# EAGLE design SparkFun_DataLogger_IoT (EAGLE 9.6.2)
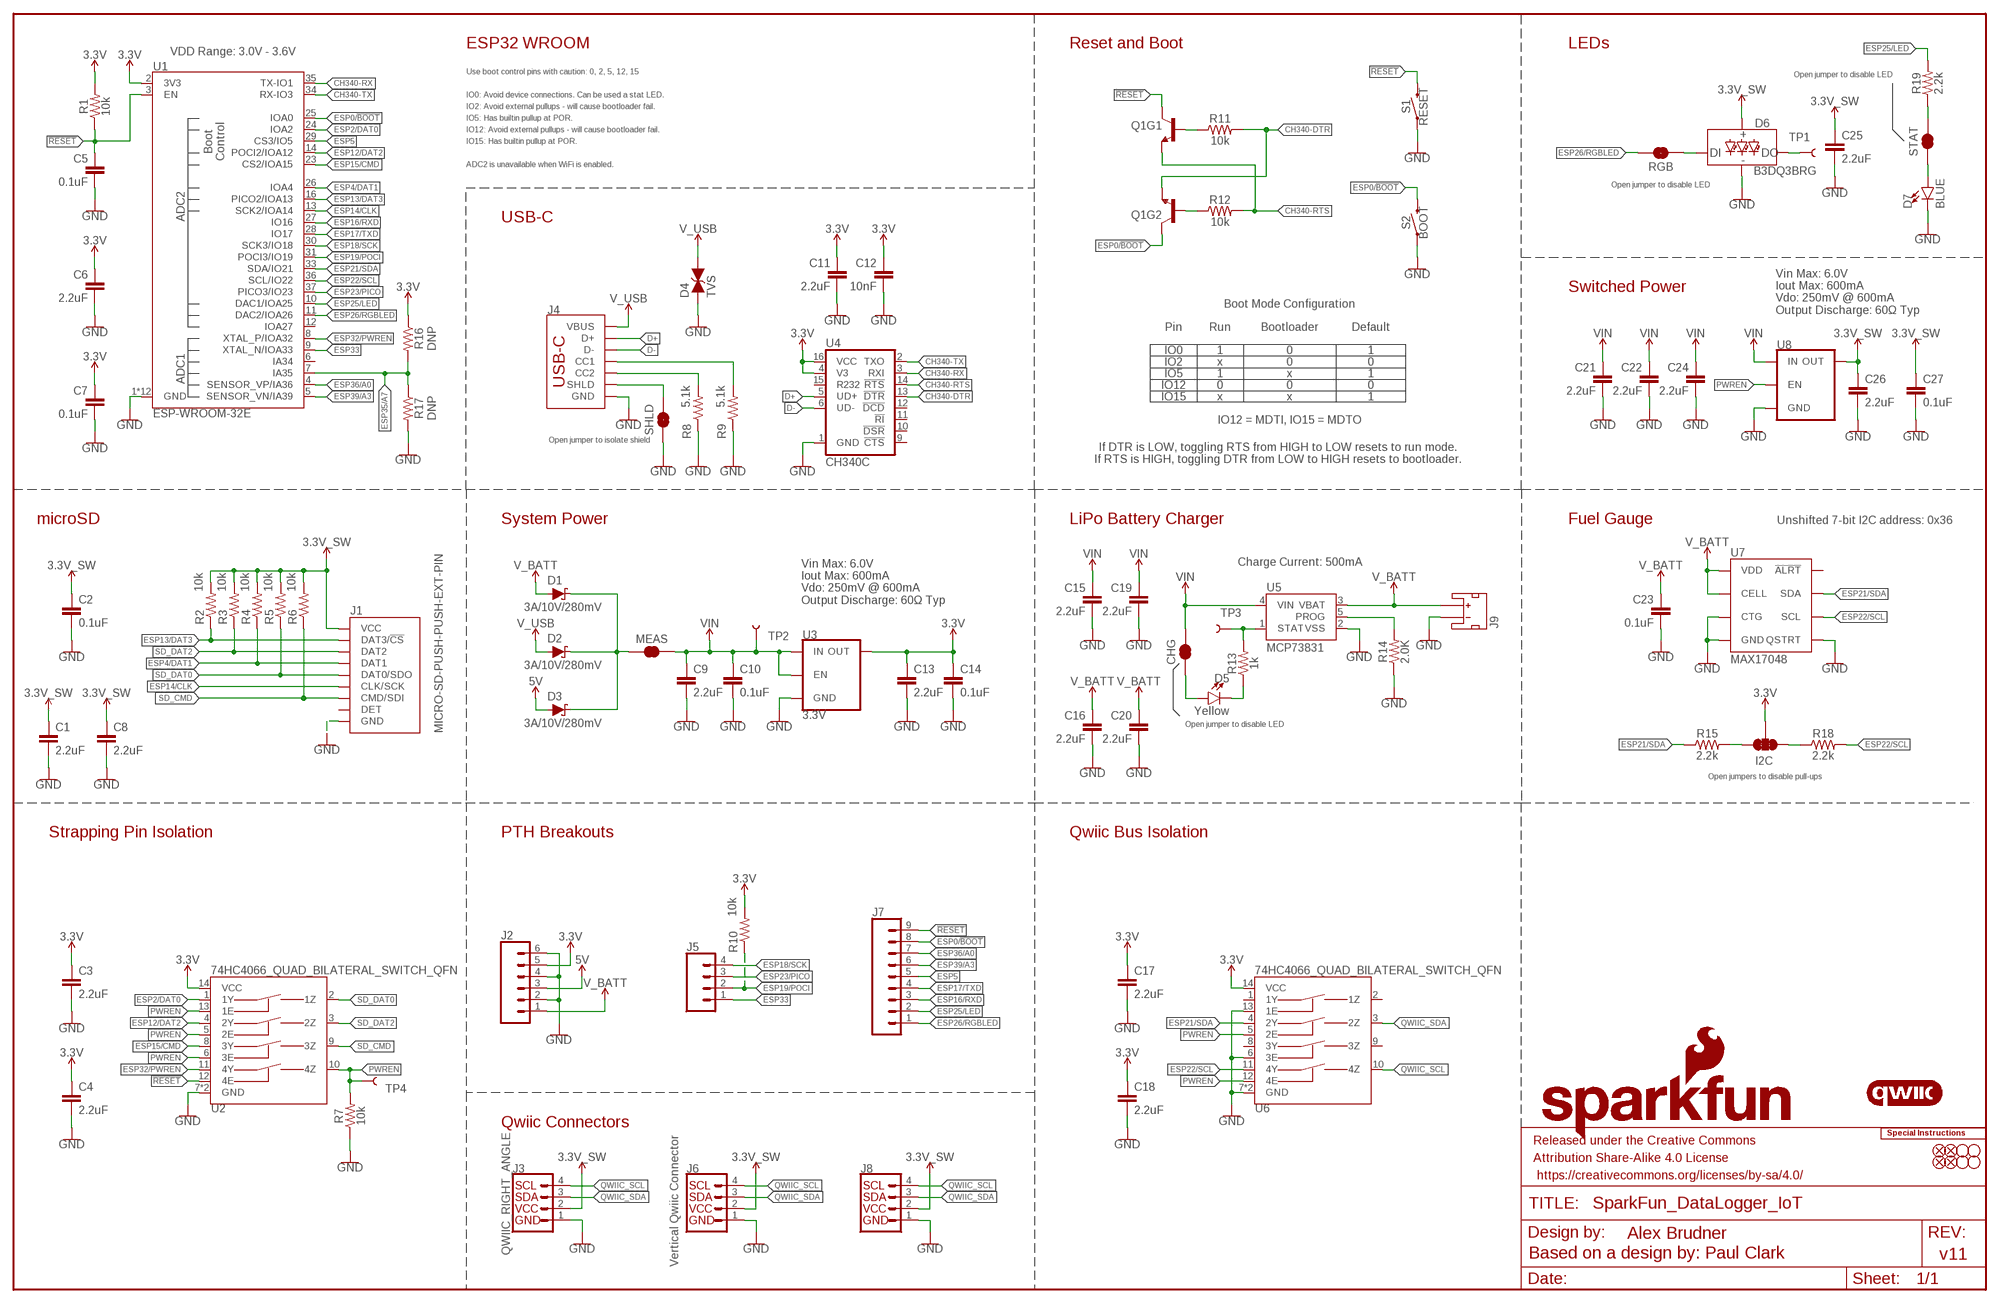
[diagram p0: schematic, sheet 1]

## Parts
C1  2.2uF  2.2UF-0402_TIGHT-10V-10%-X5R  [0402-TIGHT]
C2  0.1uF  0.1UF-0402T-6.3V-10%-X7R  [0402-TIGHT]
C3  2.2uF  2.2UF-0402_TIGHT-10V-10%-X5R  [0402-TIGHT]
C4  2.2uF  2.2UF-0402_TIGHT-10V-10%-X5R  [0402-TIGHT]
C5  0.1uF  0.1UF-0402T-6.3V-10%-X7R  [0402-TIGHT]
C6  2.2uF  2.2UF-0402_TIGHT-10V-10%-X5R  [0402-TIGHT]
C7  0.1uF  0.1UF-0402T-6.3V-10%-X7R  [0402-TIGHT]
C8  2.2uF  2.2UF-0402_TIGHT-10V-10%-X5R  [0402-TIGHT]
C9  2.2uF  2.2UF-0402_TIGHT-10V-10%-X5R  [0402-TIGHT]
C10  0.1uF  0.1UF-0402T-6.3V-10%-X7R  [0402-TIGHT]
C11  2.2uF  2.2UF-0402_TIGHT-10V-10%-X5R  [0402-TIGHT]
C12  10nF  10NF-0402T-25V-10%-X7R-WE  [0402-TIGHT]
C13  2.2uF  2.2UF-0402_TIGHT-10V-10%-X5R  [0402-TIGHT]
C14  0.1uF  0.1UF-0402T-6.3V-10%-X7R  [0402-TIGHT]
C15  2.2uF  2.2UF-0402_TIGHT-10V-10%-X5R  [0402-TIGHT]
C16  2.2uF  2.2UF-0402_TIGHT-10V-10%-X5R  [0402-TIGHT]
C17  2.2uF  2.2UF-0402_TIGHT-10V-10%-X5R  [0402-TIGHT]
C18  2.2uF  2.2UF-0402_TIGHT-10V-10%-X5R  [0402-TIGHT]
C19  2.2uF  2.2UF-0402_TIGHT-10V-10%-X5R  [0402-TIGHT]
C20  2.2uF  2.2UF-0402_TIGHT-10V-10%-X5R  [0402-TIGHT]
C21  2.2uF  2.2UF-0402_TIGHT-10V-10%-X5R  [0402-TIGHT]
C22  2.2uF  2.2UF-0402_TIGHT-10V-10%-X5R  [0402-TIGHT]
C23  0.1uF  0.1UF-0402T-6.3V-10%-X7R  [0402-TIGHT]
C24  2.2uF  2.2UF-0402_TIGHT-10V-10%-X5R  [0402-TIGHT]
C25  2.2uF  2.2UF-0402_TIGHT-10V-10%-X5R  [0402-TIGHT]
C26  2.2uF  2.2UF-0402_TIGHT-10V-10%-X5R  [0402-TIGHT]
C27  0.1uF  0.1UF-0402T-6.3V-10%-X7R  [0402-TIGHT]
CHG  JUMPER-SMT_2_NC_TRACE_SILK  [SMT-JUMPER_2_NC_TRACE_SILK]
D1  3A/10V/280mV  DIODE-SCHOTTKY-BAT60A  [SOD-323]
D2  3A/10V/280mV  DIODE-SCHOTTKY-BAT60A  [SOD-323]
D3  3A/10V/280mV  DIODE-SCHOTTKY-BAT60A  [SOD-323]
D4  TVS  DIODE_TVS  [0603]
D5  Yellow  LED-YELLOW0603  [LED-0603]
D6  B3DQ3BRG  [B3DQ3BRG]
D7  BLUE  LED-BLUE0603  [LED-0603]
FD1  FIDUCIAL1X2  [FIDUCIAL-1X2]
FD2  FIDUCIAL1X2  [FIDUCIAL-1X2]
FD3  FIDUCIAL1X2  [FIDUCIAL-1X2]
FD4  FIDUCIAL1X2  [FIDUCIAL-1X2]
FRAME1  FRAME-LEDGER  [CREATIVE_COMMONS]
H1  STAND-OFFTIGHT  [STAND-OFF-TIGHT]
H2  STAND-OFFTIGHT  [STAND-OFF-TIGHT]
H3  STAND-OFFTIGHT  [STAND-OFF-TIGHT]
H4  STAND-OFFTIGHT  [STAND-OFF-TIGHT]
I2C  JUMPER-SMT_3_2-NC_TRACE_SILK  [SMT-JUMPER_3_2-NC_TRACE_SILK]
J1  MICRO-SD-PUSH-PUSH-EXT-PIN  [MICROSD-EXTERNALPIN]
J2  CONN_06NO_SILK_NO_POP  [1X06_NO_SILK]
J3  QWIIC_RIGHT_ANGLE  QWIIC_CONNECTORJS-1MM  [JST04_1MM_RA]
J4  USB_C_4-LAYER_PADS  [USB-C-16P_4LAYER-PADS]
J5  CONN_041X04_NO_SILK_NO_POP  [1X04_NO_SILK]
J6  Vertical Qwiic Connector  QWIIC_CONNECTOR  [JST04_1MM_VERT]
J7  CONN_09NO_SILK  [1X09_NO_SILK]
J8  I2C_STANDARD_NO_SILK  [1X04_NO_SILK]
J9  JST_2MM_MALE  [JST-2-SMD]
LOGO1  SFE_LOGO_NAME.2_INCH  [SFE_LOGO_NAME_.2]
LOGO2  SFE_LOGO_FLAME.2_INCH  [SFE_LOGO_FLAME_.2]
LOGO3  SPECIAL_INSTRUCTIONS-ORDERING  [ORDERING_INSTRUCTIONS]
LOGO4  QWIIC_LOGO_6MM  [QWIIC_6MM]
MEAS  JUMPER-COMBO_2_NC_TRACE  [COMBO-JUMPER_2_NC_TRACE]
Q1  TRANS_NPN_DUAL-MBT3904DW1T1  [SC70-6]
R1  10k  10KOHM-0402T-1/16W-1%  [0402-TIGHT]
R2  10k  10KOHM-0402T-1/16W-1%  [0402-TIGHT]
R3  10k  10KOHM-0402T-1/16W-1%  [0402-TIGHT]
R4  10k  10KOHM-0402T-1/16W-1%  [0402-TIGHT]
R5  10k  10KOHM-0402T-1/16W-1%  [0402-TIGHT]
R6  10k  10KOHM-0402T-1/16W-1%  [0402-TIGHT]
R7  10k  10KOHM-0402T-1/16W-1%  [0402-TIGHT]
R8  5.1k  5.1KOHM-0402T-1/16W-1%  [0402-TIGHT]
R9  5.1k  5.1KOHM-0402T-1/16W-1%  [0402-TIGHT]
R10  10k  10KOHM-0402T-1/16W-1%  [0402-TIGHT]
R11  10k  10KOHM-0402T-1/16W-1%  [0402-TIGHT]
R12  10k  10KOHM-0402T-1/16W-1%  [0402-TIGHT]
R13  1k  1KOHM-0402T-1/16W-1%  [0402-TIGHT]
R14  2.0K  2.0KOHM-0402T-1/16W-1%  [0402-TIGHT]
R15  2.2k  2.2KOHM-0402T-1/16W-1%  [0402-TIGHT]
R16  DNP  DNP-0402T_NO_CREAM  [0402-TIGHT_NO_CREAM]
R17  DNP  DNP-0402T_NO_CREAM  [0402-TIGHT_NO_CREAM]
R18  2.2k  2.2KOHM-0402T-1/16W-1%  [0402-TIGHT]
R19  2.2k  2.2KOHM-0402T-1/16W-1%  [0402-TIGHT]
RGB  JUMPER-SMT_2_NC_TRACE_SILK  [SMT-JUMPER_2_NC_TRACE_SILK]
S1  RESET  MOMENTARY-SWITCH-SPST-SMD-RIGHT-ANGLE  [TACTILE_SWITCH_SMD_RIGHT_ANGLE]
S2  BOOT  MOMENTARY-SWITCH-SPST-SMD-RIGHT-ANGLE  [TACTILE_SWITCH_SMD_RIGHT_ANGLE]
SHLD  JUMPER-SMT_2_NC_TRACE_SILK  [SMT-JUMPER_2_NC_TRACE_SILK]
STAT  JUMPER-SMT_2_NC_TRACE_SILK  [SMT-JUMPER_2_NC_TRACE_SILK]
TP1  TEST-POINT3X5  [PAD.03X.05]
TP2  TEST-POINT3X5  [PAD.03X.05]
TP3  TEST-POINT3X5  [PAD.03X.05]
TP4  TEST-POINT3X5  [PAD.03X.05]
U1  ESP-WROOM-32E  ESP-WROOM-3232D-NARROW  [ESP-WROOM-32D-NARROW]
U2  74HC4066_QUAD_BILATERAL_SWITCH_QFN  [14-QFN]
U3  3.3V  V_REG_AP2112K-3.3V  [SOT23-5]
U4  CH340C  [SO016]
U5  MCP73831  [SOT23-5]
U6  74HC4066_QUAD_BILATERAL_SWITCH_QFN  [14-QFN]
U7  MAX17048  MAX17048DFN8  [DFN-8]
U8  3.3V  V_REG_AP2112K-3.3V  [SOT23-5]

## Nets
3.3V: C3.1 C4.1 C6.1 C7.1 C11.1 C12.1 C13.1 C14.1 C17.1 C18.1 I2C.2 J2.5 R1.2 R10.2 R16.1 U1.2(3V3) U2.14(VCC) U3.5(OUT) U4.4(V3) U4.16(VCC) U6.14(VCC)
3.3V_SW: C1.1 C2.1 C8.1 C25.1 C26.1 C27.1 D6.2(VCC) J1.4(VCC) J3.2 J6.2 J8.2 R2.2 R3.2 R4.2 R5.2 R6.2 U8.5(OUT)
5V: D3.A J2.3
!RESET!: C5.1 J7.9 Q1.3(C) R1.1 S1.2 U1.3(EN) U2.12(4E)
CH340-DTR: Q1.1(E) R11.2 U4.13(!DTR)
CH340-RTS: Q1.4(E) R12.2 U4.14(!RTS)
CH340-RX: U1.35(TX-IO1) U4.3(RXI)
CH340-TX: U1.34(RX-IO3) U4.2(TXO)
D+: J4.A6(D+) J4.B6(D+) U4.5(UD+)
D-: J4.A7(D-) J4.B7(D-) U4.6(UD-)
ESP0/!BOOT!: J7.8 Q1.6(C) S2.2 U1.25(IOA0)
ESP2/DAT0: U1.24(IOA2) U2.1(1Y)
ESP4/DAT1: J1.8(DAT1) R4.1 U1.26(IOA4)
ESP5: J7.5 U1.29(CS3/IO5)
ESP12/DAT2: U1.14(POCI2/IOA12) U2.4(2Y)
ESP13/DAT3: J1.2(DAT3/!CS!) R2.1 U1.16(PICO2/IOA13)
ESP14/CLK: J1.5(CLK/SCK) U1.13(SCK2/IOA14)
ESP15/CMD: U1.23(CS2/IOA15) U2.8(3Y)
ESP16/RXD: J7.3 U1.27(IO16)
ESP17/TXD: J7.4 U1.28(IO17)
ESP18/SCK: J5.4 U1.30(SCK3/IO18)
ESP19/POCI: J5.2 R10.1 U1.31(POCI3/IO19)
ESP21/SDA: R15.1 U1.33(SDA/IO21) U6.4(2Y) U7.8(SDA)
ESP22/SCL: R18.2 U1.36(SCL/IO22) U6.11(4Y) U7.7(SCL)
ESP23/PICO: J5.3 U1.37(PICO3/IO23)
ESP25/LED: J7.2 R19.2 U1.10(DAC1/IOA25)
ESP26/RGBLED: J7.1 RGB.2 U1.11(DAC2/IOA26)
ESP32/PWREN: U1.8(XTAL_P/IOA32) U2.11(4Y)
ESP33: J5.1 U1.9(XTAL_N/IOA33)
ESP35/A7: R16.2 R17.1 U1.7(IA35)
ESP36/A0: J7.7 U1.4(SENSOR_VP/IA36)
ESP39/A3: J7.6 U1.5(SENSOR_VN/IA39)
GND: C1.2 C2.2 C3.2 C4.2 C5.2 C6.2 C7.2 C8.2 C9.2 C10.2 C11.2 C12.2 C13.2 C14.2 C15.2 C16.2 C17.2 C18.2 C19.2 C20.2 C21.2 C22.2 C23.2 C24.2 C25.2 C26.2 C27.2 D4.1(A) D6.1(GND) D7.C J1.6(GND) J1.10(GND) J1.11(GND) J1.12(GND) J1.13(GND) J2.2 J2.4 J2.6 J3.1 J4.GND J4.GND2(GND) J6.1 J8.1 J9.1(-) R7.1 R8.1 R9.1 R14.1 R17.2 S1.1 S2.1 SHLD.1 U1.1(GND) U1.15(GND) U1.38(GND) U1.GND1(GND) U1.GNDT1(GND) U1.GNDT2(GND) U1.GNDT3(GND) U1.GNDT4(GND) U1.GNDT5(GND) U1.GNDT6(GND) U1.GNDT7(GND) U1.GNDT8(GND) U2.7(GND) U2.EPAD(GND) U3.2(GND) U4.1(GND) U5.2(VSS) U6.6(3E) U6.7(GND) U6.13(1E) U6.EPAD(GND) U7.1(CTG) U7.4(GND) U7.6(QSTRT) U7.9(GND) U8.2(GND)
N$1: J4.B5(CC2) R8.2
N$2: J4.A5(CC1) R9.2
N$3: D1.C D2.C D3.C MEAS.1 MEAS.3
N$4: Q1.2(B) R12.1
N$5: Q1.5(B) R11.1
N$6: R19.1 STAT.2
N$7: D6.4(DO) TP1.1
N$8: CHG.1 D5.A
N$9: D5.C R13.1
N$10: R13.2 TP3.1 U5.1(STAT)
N$11: R14.2 U5.5(PROG)
N$12: D6.3(DI) RGB.1
N$13: D7.A STAT.1
N$16: I2C.1 R18.1
N$17: I2C.3 R15.2
PWREN: R7.2 TP4.1 U2.5(2E) U2.6(3E) U2.10(4Z) U2.13(1E) U6.5(2E) U6.12(4E) U8.3(EN)
QWIIC_SCL: J3.4 J6.4 J8.4 U6.10(4Z)
QWIIC_SDA: J3.3 J6.3 J8.3 U6.3(2Z)
SD_CMD: J1.3(CMD/SDI) R6.1 U2.9(3Z)
SD_DAT0: J1.7(DAT0/SDO) R5.1 U2.2(1Z)
SD_DAT2: J1.1(DAT2) R3.1 U2.3(2Z)
SHIELD: J4.SHLD1(SHLD) J4.SHLD2(SHLD) J4.SHLD3(SHLD) J4.SHLD4(SHLD) SHLD.2
V_BATT: C16.1 C20.1 C23.1 D1.A J2.1 J9.2(+) U5.3(VBAT) U7.2(CELL) U7.3(VDD)
V_USB: D2.A D4.2(C) J4.VBUS1(VBUS) J4.VBUS2(VBUS)
VIN: C9.1 C10.1 C15.1 C19.1 C21.1 C22.1 C24.1 CHG.2 MEAS.2 MEAS.4 TP2.1 U3.1(IN) U3.3(EN) U5.4(VIN) U8.1(IN)
Unconnected: J1.9(DET) J9.NC1(PAD1) J9.NC2(PAD2) U1.6(IA34) U1.12(IOA27) U4.9(!CTS) U4.10(!DSR) U4.11(!RI) U4.12(!DCD) U4.15(R232) U6.1(1Y) U6.2(1Z) U6.8(3Y) U6.9(3Z) U7.5(!ALRT)

## Notes on the sheet
- VDD Range: 3.0V - 3.6V | ESP32 WROOM | Reset and Boot | LEDs
- Use boot control pins with caution: 0, 2, 5, 12, 15
- Open jumper to disable LED
- IO0: Avoid device connections. Can be used a stat LED.
- IO2: Avoid external pullups - will cause bootloader fail.
- IO5: Has builtin pullup at POR.
- IO12: Avoid external pullups - will cause bootloader fail.
- IO15: Has builtin pullup at POR.
- ADC2 is unavailable when WiFi is enabled.
- Open jumper to disable LED
- USB-C
- Switched Power
- Boot Mode Configuration
- Vin Max: 6.0V
  Iout Max: 600mA
  Vdo: 250mV @ 600mA
  Output Discharge: 60Ω Typ
- Pin | Run | Bootloader | Default
- IO0 | 1 | 0 | 1
- IO2 | x | 0 | 0
- IO5 | 1 | x | 1
- IO12 | 0 | 0 | 0
- IO15 | x | x | 1
- IO12 = MDTI, IO15 = MDTO
- Open jumper to isolate shield
- If DTR is LOW, toggling RTS from HIGH to LOW resets to run mode.
  If RTS is HIGH, toggling DTR from LOW to HIGH resets to bootloader.
- microSD | System Power | LiPo Battery Charger | Fuel Gauge | Unshifted 7-bit I2C address: 0x36
- Charge Current: 500mA
- Vin Max: 6.0V
  Iout Max: 600mA
  Vdo: 250mV @ 600mA
  Output Discharge: 60Ω Typ
- TP3
- TP2
- Open jumper to disable LED
- Open jumpers to disable pull-ups
- Strapping Pin Isolation | PTH Breakouts | Qwiic Bus Isolation
- TP4
- Qwiic Connectors
- Based on a design by: Paul Clark

## Library data of the parts
C1 C3 C4 C6 C8 C9 C11 C13 C15-C22 C24-C26 = SparkFun-Capacitors:2.2UF: 2.2µF ceramic capacitors A capacitor is a passive two-terminal electrical component used to store electrical energy temporarily in an electric field.; PROD_ID: CAP-14232
C2 C5 C7 C10 C14 C23 C27 = SparkFun-Capacitors:0.1UF: 0.1µF ceramic capacitors A capacitor is a passive two-terminal electrical component used to store electrical energy temporarily in an electric field.; PROD_ID: CAP-14993
C12 = SparkFun-Capacitors:10NF: 0.01uF/10nF/10,000pF ceramic capacitors A capacitor is a passive two-terminal electrical component used to store electrical energy temporarily in an electric field. CAP-09321; PROD_ID: CAP-16508
CHG RGB SHLD STAT = SparkFun-Jumpers:JUMPER-SMT_2_NC_TRACE: Normally closed trace jumper This jumper has a trace between two pads so it's normally closed (NC). Use a razor knife to open the connection. For best results follow the IPC guidelines for cutting traces: Cutout at least 0.063 mm (0.005 in). Remove all loose material to clean up the cut area. Seal the cut with an approved epoxy. Reapply solder to reclose the connection.
D1-D3 = SparkFun-DiscreteSemi:DIODE-SCHOTTKY: Schottky diode A Schottky diode is a semiconductor diode which has a low forward voltage drop and a very fast switching action.; PROD_ID: DIO-14072
D4 = SparkFun-DiscreteSemi:DIODE_TVS; PROD_ID: DIO-14502; VALUE: 24V
D5 = SparkFun-LED:LED-YELLOW: Yellow SMD LED Used in manufacturing several products at SparkFun. Packages: 0603 - SMD 0603 package[Product Link] <http://www.kingbrightusa.com/product.asp?catalog_name=LED&product_id=APT1608SYCK> 0603 -SMART - SMART SMD 0603 package (more efficient/more expensive) [Product Link] <http://www.osram-os.com/osram_os/en/products/product-catalog/led-light-emitting-diodes/smartled-0603/ly-l29k/index.jsp> LilyPad - SMD1206 package[Product Datasheet] <https://www.sparkfun.com/datasheets/DevTools/LilyPad/Q150YUS4.pdf> SparkFun Products: Blynk Board <https://www.sparkfun.com/products/13794> IOIO-OTG <https://www.sparkfun.com/products/13613> XBee Explorer Serial <https://www.sparkfun.com/products/13225>; PROD_ID: DIO-09003
D6 = RA_RGB:B3DQ3BRG; PROD_ID: DIO-18471
D7 = SparkFun-LED:LED-BLUE: Blue SMD LED Used in manufacturing of various products at SparkFun Packages: 0603 - SMD 0603 package [Product Link] <http://www.digikey.com/product-detail/en/SMLE12BC7TT86/511-1589-2-ND/1641808> 1206 - SMD1206 package [Product Link] <http://www.digikey.com/product-detail/en/lite-on-inc/LTST-C150TBKT/160-1643-1-ND/573584> SparkFun Products: ESP8266 Thing-Dev Board <https://www.sparkfun.com/products/13711> RedBoard <https://www.sparkfun.com/products/12757>; PROD_ID: DIO-08575
FD1-FD4 = SparkFun-Aesthetics:FIDUCIAL: Fiducial Alignment Points Point-of-reference for pick-and-place machines and other optical instruments.
FRAME1 = SparkFun-Aesthetics:FRAME-LEDGER: Schematic Frame - Ledger Standard 11x14 US Ledger frame; DESIGNER: Alex Brudner; REV: v11
H1-H4 = SparkFun-Hardware:STAND-OFF: Stand Off Drill holes for mechanically mounting via screws, standoffs, etc. Note: Use the keepout ring to avoid running the screw head into surrounding components. Variant Overviews STAND-OFF - Mechanical footprint for a #4 phillips button head screw. STAND-OFF-TIGHT - Mechanical footprint for a #4 phillips button head screw, Example SparkFun Products Screw - Phillips Head (1/4", 4-40, 10 pack) <https://www.sparkfun.com/products/10453> (PRT-10453) Screw - Phillips Head (1/2", 4-40, 10 pack) <https://www.sparkfun.com/products/10452> (PRT-10452) Screw - Phillips Head (3/4", 4-40, 10 pack) <https://www.sparkfun.com/products/10451> (PRT-10451) Screw - Phillips Head (1", 4-40, 10 pack) <https://www.sparkfun.com/products/10450> (PRT-10450)
I2C = SparkFun-Jumpers:JUMPER-SMT_3_2-NC_TRACE: Normally closed trace jumper (2 of 2 connections) This jumper has a trace between all three pads so they are normally closed (NC). Use a razor knife to open the connection(s). For best results follow the IPC guidelines for cutting traces: Cutout at least 0.063 mm (0.005 in). Remove all loose material to clean up the cut area. Seal the cut with an approved epoxy. Reapply solder to reclose the connection(s).
J1 = SparkFun-Connectors:MICRO-SD: microSD Socket for Transflash Various sockets for µSD. tDoc lines correctly indicate media card edge positions when inserting (unlocked, locked, depressed). NOTE: CD1 and CD2 are connected internally, and the default detect state of the socket is detect pin to ground. SparkFun Products: WAV Trigger <https://www.sparkfun.com/products/13660> CAN-Bus Shield <https://www.sparkfun.com/products/13262> SparkFun Level Shifing microSD Breakout <https://www.sparkfun.com/products/13743>; PROD_ID: CONN-16110
J2 = SparkFun-Connectors:CONN_06: Multi connection point. Often used as Generic Header-pin footprint for 0.1 inch spaced/style header connections On any of the 0.1 inch spaced packages, you can populate with these: Break Away Headers - Straight <https://www.sparkfun.com/products/116> (PRT-00116) Break Away Male Headers - Right Angle <https://www.sparkfun.com/products/553> (PRT-00553) Female Headers <https://www.sparkfun.com/products/115> (PRT-00115) Break Away Headers - Machine Pin <https://www.sparkfun.com/products/117> (PRT-00117) Break Away Female Headers - Swiss Machine Pin <https://www.sparkfun.com/products/743> (PRT-00743) Arduino Stackable Header - 6 Pin <https://www.sparkfun.com/products/9280> (PRT-09280) Screw Terminals 2.54mm Pitch (6-Pin) <https://www.sparkfun.com/products/16499> (PRT-16499) For SCREWTERMINALS and SPRING TERMINALS visit here: Screw Terimnals on SparkFun.com <https://www.sparkfun.com/search/results?term=Screw+Terminals> (5mm/3.5mm/2.54mm spacing) This device is also useful as a general connection point to wire up your design to another part of your project. Our various solder wires solder well into these plated through hole pads. Hook-Up Wire - Assortment (Stranded, 22 AWG) <https://www.sparkfun.com/products/11375> (PRT-11375) Hook-Up Wire - Assortment (Solid Core, 22 AWG) <https://www.sparkfun.com/products/11367> (PRT-11367) View the entire wire category on our website here <https://www.sparkfun.com/categories/141>
J3 = SparkFun-Connectors:QWIIC_CONNECTOR: SparkFun I2C Standard Qwiic Connector An SMD 1mm pitch JST connector makes it easy and quick (get it? Qwiic?) to connect I2C devices to each other. The Qwiic system <http://www.sparkfun.com/qwiic> enables fast and solderless connection between popular platforms and various sensors and actuators. We carry 200mm <https://www.sparkfun.com/products/14204>, 100mm <https://www.sparkfun.com/products/14205>, 50mm <https://www.sparkfun.com/products/14206>, and breadboard friendly <https://www.sparkfun.com/products/14207> Qwiic cables. We also offer 10 pcs strips <https://www.sparkfun.com/products/14323> the SMD connectors.; PROD_ID: CONN-13694
J4 = SparkFun-Connectors:USB_C: USB Type C 16Pin Connector Super Speed pins not available on the 16-pin purely SMD connector so this part is best for USB 2.0 implementations. D1 and D2 are tied together enabling D+/- no matter which way the cable is plugged into the connector. The two channel configuration pins (CC1/2) are exposed. These are normally connected to ground via 5.1k resistors but can be reconfigured for high current/high power applications. **4-LAYER BOARD WARNING!!** If designing 4-layer board, make sure to select the variant _4-LAYER-ISOLATED. The linked footprint (USB-C-16-4LAYER-ISOLATED) includes some very necessary cutout polygons in the inner layers (2 and 15). This prevents the PTH mounting shield legs on the USB connector from electrically connecting any other polygons on the inner layers (usually VCC and GND).; PROD_ID: CONN-14122
J5 = SparkFun-Connectors:CONN_04: Multi connection point. Often used as Generic Header-pin footprint for 0.1 inch spaced/style header connections On any of the 0.1 inch spaced packages, you can populate with these: Break Away Headers - Straight <https://www.sparkfun.com/products/116> (PRT-00116) Break Away Male Headers - Right Angle <https://www.sparkfun.com/products/553> (PRT-00553) Female Headers <https://www.sparkfun.com/products/115> (PRT-00115) Break Away Headers - Machine Pin <https://www.sparkfun.com/products/117> (PRT-00117) Break Away Female Headers - Swiss Machine Pin <https://www.sparkfun.com/products/743> (PRT-00743) For SCREWTERMINALS and SPRING TERMINALS visit here: Screw Terimnals on SparkFun.com <https://www.sparkfun.com/search/results?term=Screw+Terminals> (5mm/3.5mm/2.54mm spacing) This device is also useful as a general connection point to wire up your design to another part of your project. Our various solder wires solder well into these plated through hole pads. Hook-Up Wire - Assortment (Stranded, 22 AWG) <https://www.sparkfun.com/products/11375> (PRT-11375) Hook-Up Wire - Assortment (Solid Core, 22 AWG) <https://www.sparkfun.com/products/11367> (PRT-11367) View the entire wire category on our website here <https://www.sparkfun.com/categories/141> Special notes: Molex polarized connector foot print use with SKU : PRT-08231 with associated crimp pins and housings. 1MM SMD Version SKU: PRT-10208
J6 = SparkFun-Connectors:QWIIC_CONNECTOR: SparkFun I2C Standard Qwiic Connector An SMD 1mm pitch JST connector makes it easy and quick (get it? Qwiic?) to connect I2C devices to each other. The Qwiic system <http://www.sparkfun.com/qwiic> enables fast and solderless connection between popular platforms and various sensors and actuators. We carry 200mm <https://www.sparkfun.com/products/14204>, 100mm <https://www.sparkfun.com/products/14205>, 50mm <https://www.sparkfun.com/products/14206>, and breadboard friendly <https://www.sparkfun.com/products/14207> Qwiic cables. We also offer 10 pcs strips <https://www.sparkfun.com/products/14323> the SMD connectors.; PROD_ID: CONN-14483
J7 = SparkFun-Connectors:CONN_09: Multi connection point. Often used as Generic Header-pin footprint for 0.1 inch spaced/style header connections On any of the 0.1 inch spaced packages, you can populate with these: Break Away Headers - Straight <https://www.sparkfun.com/products/116> (PRT-00116) Break Away Male Headers - Right Angle <https://www.sparkfun.com/products/553> (PRT-00553) Female Headers <https://www.sparkfun.com/products/115> (PRT-00115) Break Away Headers - Machine Pin <https://www.sparkfun.com/products/117> (PRT-00117) Break Away Female Headers - Swiss Machine Pin <https://www.sparkfun.com/products/743> (PRT-00743) For SCREWTERMINALS and SPRING TERMINALS visit here: Screw Terimnals on SparkFun.com <https://www.sparkfun.com/search/results?term=Screw+Terminals> (5mm/3.5mm/2.54mm spacing) This device is also useful as a general connection point to wire up your design to another part of your project. Our various solder wires solder well into these plated through hole pads. Hook-Up Wire - Assortment (Stranded, 22 AWG) <https://www.sparkfun.com/products/11375> (PRT-11375) Hook-Up Wire - Assortment (Solid Core, 22 AWG) <https://www.sparkfun.com/products/11367> (PRT-11367) View the entire wire category on our website here <https://www.sparkfun.com/categories/141> Special notes: Molex polarized connector foot print use with SKU : PRT-08231 with associated crimp pins and housings. 1MM SMD Version SKU: PRT-10208 NOTES ON THE VARIANTS LOCK and LOCK_LONGPADS... This footprint was designed to help hold the alignment of a through-hole component (i.e. 6-pin header) while soldering it into place. You may notice that each hole has been shifted either up or down by 0.005 of an inch from it's more standard position (which is a perfectly straight line). This slight alteration caused the pins (the squares in the middle) to touch the edges of the holes. Because they are alternating, it causes a "brace" to hold the component in place. 0.005 has proven to be the perfect amount of "off-center" position when using our standard breakaway headers. Although looks a little odd when you look at the bare footprint, once you have a header in there, the alteration is very hard to notice. Also,if you push a header all the way into place, it is covered up entirely on the bottom side.
J8 = SparkFun-Connectors:I2C_STANDARD: SparkFun I2C Standard Pinout Header SparkFun has standardized on a pinout for all I2C based sensor breakouts. This pinout allows I2C boards to be plugged directly into the headers on Arduino Uno compatible boards, and to be daisy chained easily. Example SparkFun Products: SparkFun Atmospheric Sensor Breakout - BME280 <https://www.sparkfun.com/products/13676> SparkFun Altitude/Pressure Sensor Breakout - MPL3115A2 <https://www.sparkfun.com/products/11084> SparkFun TOF Range Finder Sensor - VL6180 <https://www.sparkfun.com/products/12785>
J9 = SparkFun-Connectors:JST_2MM_MALE: JST 2MM MALE RA CONNECTOR Two pin, compact surface mount connector. Commonly used as a battery input connection point. We really like the solid locking feeling and high current rating on these small connectors. We use these all the time as battery connectors. Mates to single-cell LiPo batteries. Here is the connector we sell at SparkFun: JST Right Angle Connector - White <https://www.sparkfun.com/products/8612> (PRT-08612) Datasheet <http://www.sparkfun.com/datasheets/Prototyping/Connectors/JST-Horizontal.pdf> It was used on these SparkFun products: SparkFun MOSFET Power Controller <https://www.sparkfun.com/products/11214> (PRT-11214) SparkFun Battery Babysitter - LiPo Battery Manager <https://www.sparkfun.com/products/13777> (PRT-13777) And many, many others that required a lipo battery connection.; PROD_ID: CONN-11443; SF_ID: PRT-08612
LOGO1 = SparkFun-Aesthetics:SFE_LOGO_NAME: SparkFun Font Logo This is the SparkFun name logo. The logo on the schematic will always be the same size; the package variant is the height of the flame part of the logo (or the height the flame would be, if it were drawn). Default layer for the logo on the board is tSilk.
LOGO2 = SparkFun-Aesthetics:SFE_LOGO_FLAME: SparkFun Flame Logo This is the SparkFun flame logo. The logo on the schematic will always be the same size; the package variant is the height of the flame. Default layer for the logo on the board is tSilk.
LOGO3 = SparkFun-Aesthetics:SPECIAL_INSTRUCTIONS: Special Ordering/Production Instructions Alert Symbol for special PCB ordering instructions or unique production process warnings. Ordering Instructions Production Instructions Types of information that should be added to box: Copper weight Soldermask color Silk color PCB thickness Number of layers PCB Standard: 1.6mm FR4 1 oz copper immersion silver plating red soldermask white silkscreen Types of information that should be added to box: Special wash requirements Depaneling instructions Humidification Glue curing Default text settings: 0.07 inch 9% ratio 50% line distance
LOGO4 = SparkFun-Aesthetics:QWIIC_LOGO: Qwiic Logos for placement on schematic and PCB. The 5.5mm silk logo is best for placing next to Qwiic connector.
MEAS = SparkFun-Jumpers:JUMPER-COMBO_2_NC_TRACE
Q1 = SparkFun-DiscreteSemi:TRANS_NPN_DUAL: Dual NPN Transistors in Single Package The MBT3904W1 puts two general purpose 3904 NPN transistors in a single package. Datasheet <http://www.onsemi.com/pub_link/Collateral/MBT3904DW1T1-D.PDF> SparkFun Products: SparkFun ESP32 Thing <https://www.sparkfun.com/products/13907>; PROD_ID: TRANS-13337
R1-R7 R10-R12 = SparkFun-Resistors:10KOHM: 10kΩ resistor A resistor is a passive two-terminal electrical component that implements electrical resistance as a circuit element. Resistors act to reduce current flow, and, at the same time, act to lower voltage levels within circuits. - Wikipedia; PROD_ID: RES-14241
R8 R9 = SparkFun-Resistors:5.1KOHM; PROD_ID: RES-14340
R13 = SparkFun-Resistors:1KOHM: 1kΩ resistor A resistor is a passive two-terminal electrical component that implements electrical resistance as a circuit element. Resistors act to reduce current flow, and, at the same time, act to lower voltage levels within circuits. - Wikipedia; PROD_ID: RES-14342
R14 = SparkFun-Resistors:2.0KOHM: 2kΩ resistor A resistor is a passive two-terminal electrical component that implements electrical resistance as a circuit element. Resistors act to reduce current flow, and, at the same time, act to lower voltage levels within circuits. - Wikipedia; PROD_ID: RES-15406
R15 R18 R19 = SparkFun-Resistors:2.2KOHM: 2.2kΩ resistor A resistor is a passive two-terminal electrical component that implements electrical resistance as a circuit element. Resistors act to reduce current flow, and, at the same time, act to lower voltage levels within circuits. - Wikipedia; PROD_ID: RES-14341
R16 R17 = SparkFun-Resistors:DNP: Do-Not-Populate resistor A resistor is a passive two-terminal electrical component that implements electrical resistance as a circuit element. Resistors act to reduce current flow, and, at the same time, act to lower voltage levels within circuits. - Wikipedia
S1 S2 = SparkFun-Switches:MOMENTARY-SWITCH-SPST: Momentary Switch (Pushbutton) - SPST Normally-open (NO) SPST momentary switches (buttons, pushbuttons). Variants PTH-12MM - 12mm square, through-hole Momentary Pushbutton Switch - 12mm Square <https://www.sparkfun.com/products/9190> (COM-09190) PTH-6.0MM, PTH-6.0MM-KIT - 6.0mm square, through-hole Mini Pushbutton Switch <https://www.sparkfun.com/products/97> (COM-00097) KIT package intended for soldering kit's - only one side of pads' copper is exposed. PTH-RIGHT-ANGLE-KIT - Right-angle, through-hole Right Angle Tactile Button <https://www.sparkfun.com/products/10791> - Used on SparkFun BigTime Watch Kit <https://www.sparkfun.com/products/11734> SMD-12MM - 12mm square, surface-mount Tactile Button - SMD (12mm) <https://www.sparkfun.com/products/12993> (COM-12993) Used on SparkFun PicoBoard <https://www.sparkfun.com/products/11888> SMD-4.5MM - 4.5mm Square Trackball Switch Used on SparkFun Blackberry Trackballer Breakout <https://www.sparkfun.com/products/13169> SMD-4.6MMX2.8MM - 4.60mm x 2.80mm, surface mount Used on SparkFun Pro Micro - RP2040 <https://www.sparkfun.com/products/17717> SMD-5.2MM, SMD-5.2-REDUNDANT - 5.2mm square, surface-mount Mini Pushbutton Switch - SMD <https://www.sparkfun.com/products/8720> (COM-08720) Used on Arduino Pro Mini <https://www.sparkfun.com/products/11114> REDUNDANT package connects both switch circuits together SMD-6.0X3.5MM - 6.0 x 3.5mm, surface mount Momentary Reset Switch SMD <https://www.sparkfun.com/products/8229> (COM-08229) SMD-6.2MM-TALL - 6.2mm square, surface mount Tactile Button - SMD (6mm) <https://www.sparkfun.com/products/12992> Used on SparkFun Digital Sandbox <https://www.sparkfun.com/products/12651> SMD-RIGHT-ANGLE - Right-angle, surface mount Used on SparkFun Block for Intel® Edison - Arduino <https://www.sparkfun.com/products/13036>; PROD_ID: COMP-12265
TP1-TP4 = SparkFun-Connectors:TEST-POINT: SparkFun Test Points Bare copper test points for troubleshooting or In-Circuit-Testing. These are used by our Production team for verifying production board runs using pogo-pins on test beds. SparkFun Products: SparkFun LSM9DS1 Breakout <https://www.sparkfun.com/products/13284> SparkFun PSOC <https://www.sparkfun.com/products/13714> SparkFun Load Cell Amplifier <https://www.sparkfun.com/products/13879>
U1 = SparkFun-RF:ESP-WROOM-32: ESP-WROOM-32D - trace antenna (includes keepout) ESP-WROOM-32U - U.FL antenna connector Includes both "standard" footprints and "narrow" version (for use with tighter layouts).; PROD_ID: IC-15676
U2 U6 = SparkFun-IC-Logic:74HC4066_QUAD_BILATERAL_SWITCH: Nexperia Quad Bilateral Switch The 74HC4066 is a quad single pole, single throw analog switch. Each switch features two input/output terminals (nY and nZ) and an active HIGH enable input (nE). When nE is LOW, the analog switch is turned off. Inputs include clamp diodes. This enables the use of current limiting resistors to interface inputs to voltages in excess of VCC. Datasheet <https://assets.nexperia.com/documents/data-sheet/74HC_HCT4066.pdf>; PROD_ID: IC-16528
U3 U8 = SparkFun-IC-Power:V_REG_AP2112: AP2112 - 600mA CMOS LDO Regulator w/ Enable The AP2112 is CMOS process low dropout linear regulator with enable function, the regulator delivers a guaranteed 600mA (min.) continuous load current. Features Output Voltage Accuracy: ±1.5% Output Current: 600mA (Min.) Foldback Short Current Protection: 50mA Enable Function to Turn ON/OFF VOUT Low Dropout Voltage (3.3V): 250mV (Typ.) @IOUT=600mA Excellent Load Regulation: 0.2%/A (Typ.) Excellent Line Regulation: 0.02%/V (Typ.) Low Quiescent Current: 55μA (Typ.) Low Standby Current: 0.01μA (Typ.) Low Output Noise: 50μVRMS PSRR: 100Hz -65dB, 1kHz -65dB OTSD Protection Stable with 1.0μF Flexible Cap: Ceramic, Tantalum and Aluminum Electrolytic Operation Temperature Range: -40°C to 85°C ESD: MM 400V, HBM 4000V; PROD_ID: VREG-12457
U4 = SparkFun-IC-Comms:CH340C; PROD_ID: IC-14038
U5 = SparkFun-IC-Power:MCP73831: MCP73831T Li-Ion, Li-Pol Controller Miniature single cell, fully integrated Li-Ion, Li-polymer charge management controller Datasheet <http://ww1.microchip.com/downloads/en/DeviceDoc/20001984g.pdf> SparkFun Products: SparkFun ESP32 Thing <https://www.sparkfun.com/products/13907> SparkFun 9DoF Razor IMU M0 <https://www.sparkfun.com/products/14001>; PROD_ID: IC-09995
U7 = SparkFun-IC-Power:MAX17048: Micropower 1-Cell Li+ ModelGauge SparkFun Products Qduino Mini <https://www.sparkfun.com/products/13614> (DEV-13614); PROD_ID: IC-12551

## Board
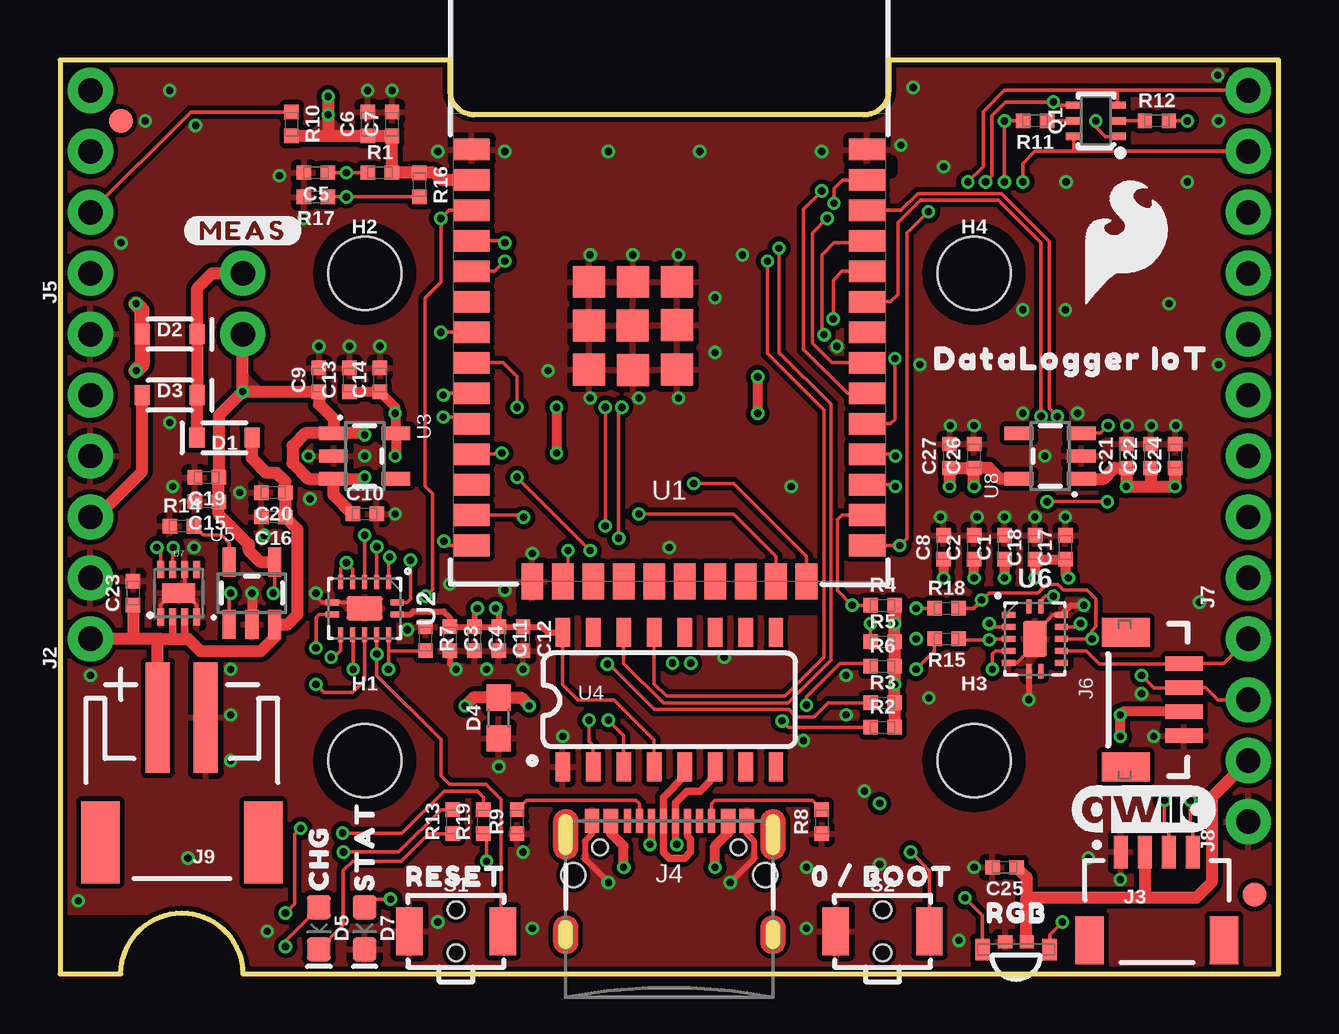
[diagram p1: board, top side]
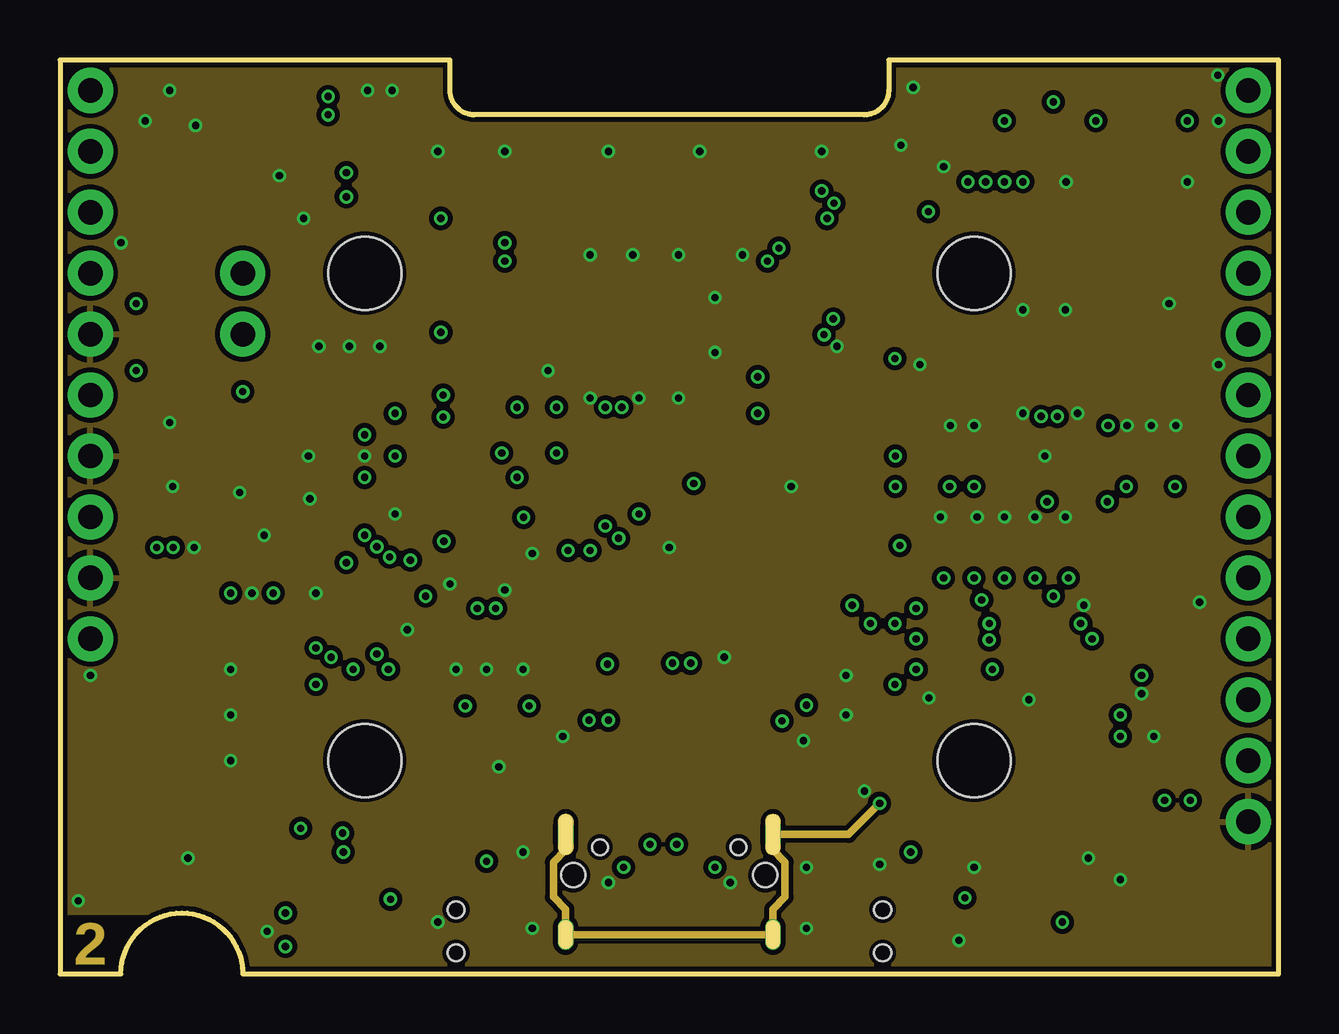
[diagram p2: board, inner layer Route2]
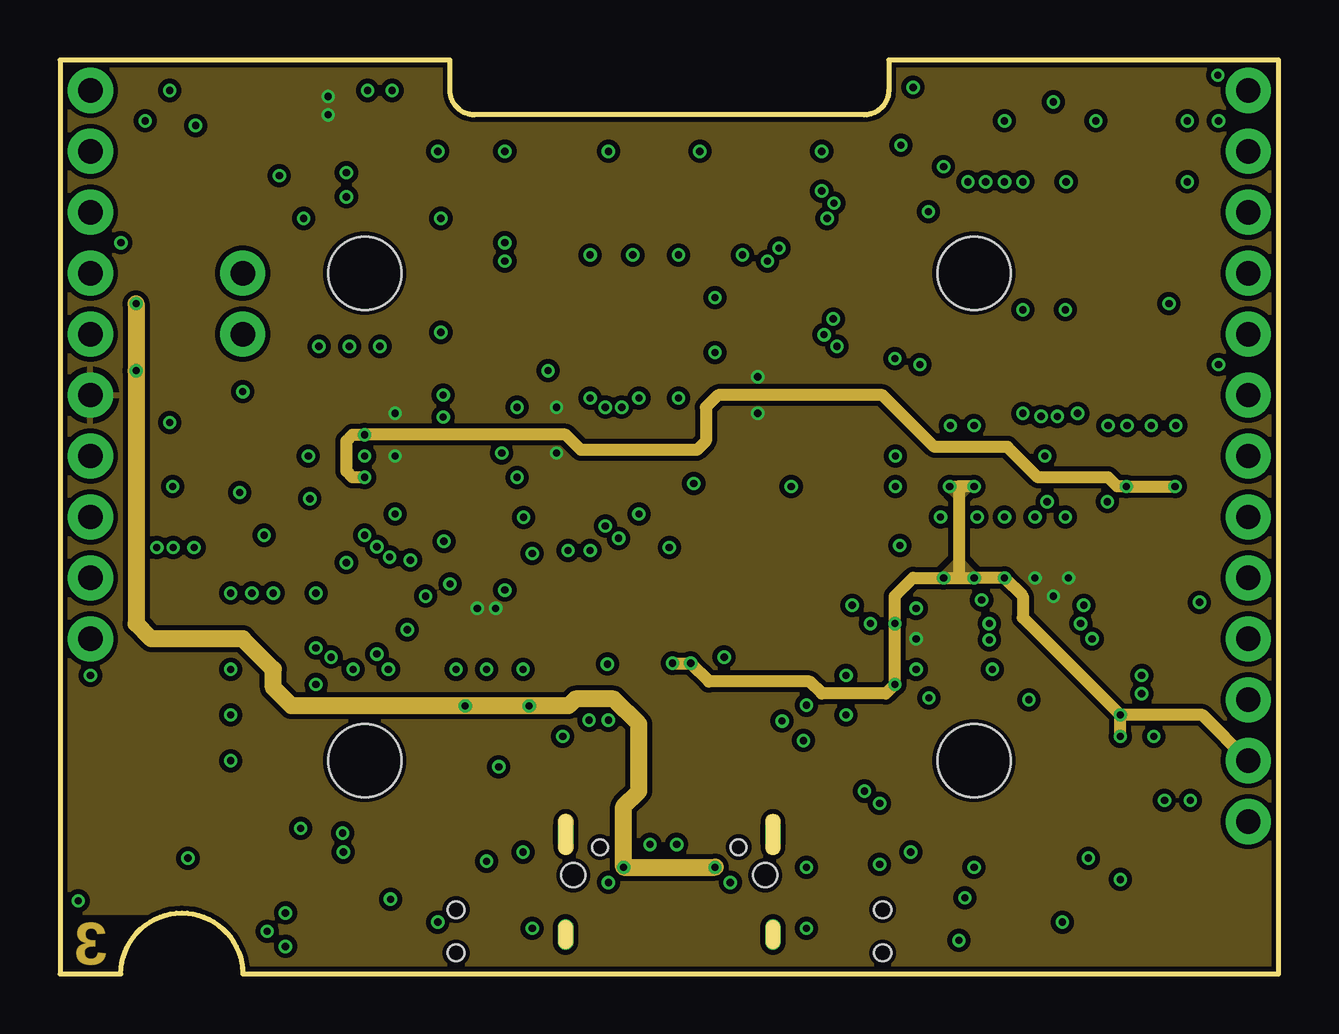
[diagram p3: board, inner layer Route15]
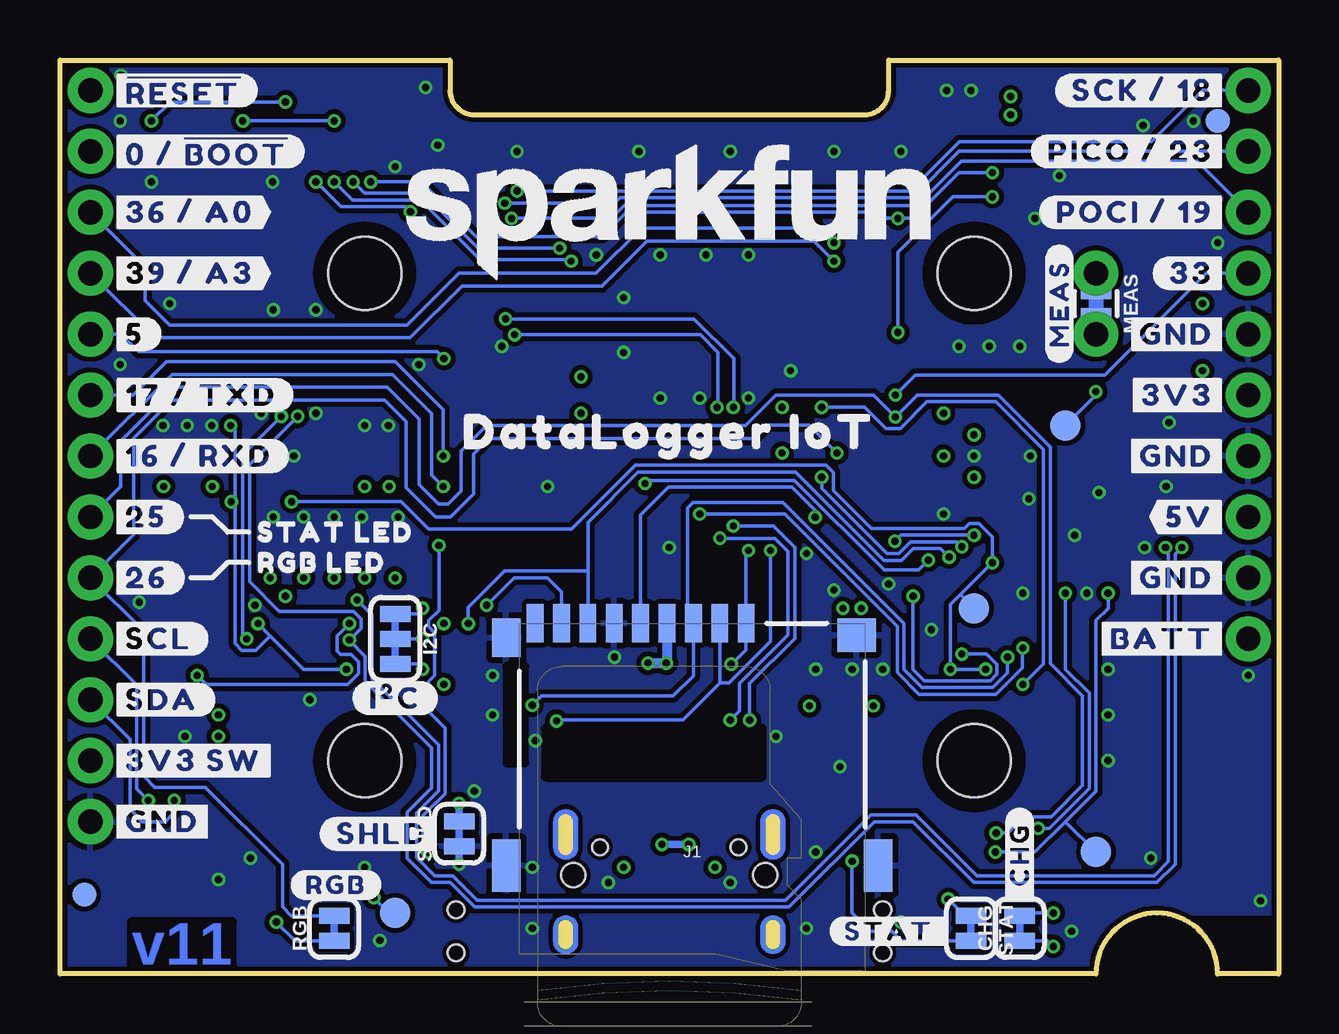
[diagram p4: board, bottom side, seen from below]

Size 50.8 x 38.1 mm. Coordinates in mm from the lower left corner, seen from the top.
Outline: 0,0 2.54,0 arc-90 5.08,2.54 arc-90 7.62,0 50.8,0 50.8,38.1 34.54,38.1 34.54,36.83 arc-90 33.53,35.81 17.27,35.81 arc-90 16.26,36.83 16.26,38.1 0,38.1 0,0
Copper layers (1*2*15*16): Top 0.035559375mm / dielectric 0.47751875mm / Route2 0.035559375mm / dielectric 0.47751875mm / Route15 0.035559375mm / dielectric 0.47751875mm / Bottom 0.035559375mm
Design rules "SparkFun-4-Layer-Minimum-JLCPCB": minimum track width 5mil, minimum drill 0.2mm, track to track 5mil, track to pad 5mil, pad to pad 5mil, via to via 5mil, smd to smd 5mil, copper to edge 7mil, drill to drill 7mil, minimum pad ring 5mil, minimum via ring 5mil, stop-mask expansion 2.5mil, vias tented up to drill 25mil, thermal gap 10mil
tRestrict: area 39.1,0.5 to 39.6,0.8; 2 lines

### Footprints (pad centres in the part's own frame; a part is rotated, then mirrored left to right if it is on the bottom)
0402-TIGHT = smd 0.6 x 0.6: 1 -0.5,0; 2 0.5,0
SMT-JUMPER_2_NC_TRACE_SILK = smd 0.66 x 1.27: 1 -0.521,0; 2 0.521,0
SOD-323 = smd 0.63 x 0.83: A 1.15,0; C -1.15,0
0603 = smd 1.1 x 1: 1 -0.85,0; 2 0.85,0
LED-0603 = smd 1 x 1: A -0.877,0; C 0.877,0
B3DQ3BRG = smd 0.55 x 0.6: 1 -0.325,-0.45; 2 -0.325,0.45 | smd 0.9 x 0.6: 3 0,1.4; 4 0,-1.4
FIDUCIAL-1X2 = smd 1 x 1: 1 0,0
STAND-OFF-TIGHT = hole 3.048: 0,0
SMT-JUMPER_3_2-NC_TRACE_SILK = smd 0.66 x 1.27: 1 -1.041,0; 2 0,0; 3 1.041,0
MICROSD-EXTERNALPIN = smd 0.7 x 1.6: 1 2.25,10.5; 2 1.15,10.5; 3 0.05,10.5; 4 -1.05,10.5; 5 -2.15,10.5; 6 -3.25,10.5; 7 -4.35,10.5; 8 -5.45,10.5; 9 -6.55,10.5 | smd 1.2 x 1.6: 10 -7.75,9.9 | smd 1.2 x 2.2: 11 -7.75,0.4; 12 7.75,0.4 | smd 1.6 x 1.4: 13 6.85,10 | hole 1: 3.05,0; -4.95,0
1X06_NO_SILK = drill 1.016 pad 1.88: 1 0,0; 2 2.54,0; 3 5.08,0; 4 7.62,0; 5 10.16,0; 6 12.7,0
JST04_1MM_RA = smd 0.6 x 1.35: 1 -1.5,0; 2 -0.5,0; 3 0.5,0; 4 1.5,0 | smd 1.2 x 2: NC1 2.8,-3.675; NC2 -2.8,-3.675
USB-C-16P_4LAYER-PADS = smd 0.3 x 1: A5 -1.25,-0.34; A6 -0.25,-0.34; A7 0.25,-0.34; A8 1.25,-0.34; B5 1.75,-0.34; B6 0.75,-0.34; B7 -0.75,-0.34; B8 -1.75,-0.34 | smd 0.6 x 1: GND -3.225,-0.34; GND2 3.225,-0.34; VBUS1 -2.45,-0.34; VBUS2 2.45,-0.34 | drill 0.4 pad 0.6 long: SHLD1 -4.318,-0.915; SHLD2 4.318,-0.915; SHLD3 -4.318,-5.095; SHLD4 4.318,-5.095 | hole 0.65: -2.89,-1.445; 2.89,-1.445
1X04_NO_SILK = drill 1.016 pad 1.88: 1 0,0; 2 2.54,0; 3 5.08,0; 4 7.62,0
JST04_1MM_VERT = smd 0.6 x 1.55: 1 -1.5,0.775; 2 -0.5,0.775; 3 0.5,0.775; 4 1.5,0.775 | smd 1.2 x 2: NC1 -2.8,3.2; NC2 2.8,3.2
1X09_NO_SILK = drill 1.016 pad 1.88: 1 0,0; 2 2.54,0; 3 5.08,0; 4 7.62,0; 5 10.16,0; 6 12.7,0; 7 15.24,0; 8 17.78,0; 9 20.32,0
JST-2-SMD = smd 1 x 4.6: 1 -1,-3.7; 2 1,-3.7 | smd 1.6 x 3.4: NC1 -3.4,1.5; NC2 3.4,1.5
COMBO-JUMPER_2_NC_TRACE = smd 0.635 x 1.27: 1 -0.508,0; 2 0.508,0 | drill 1.016 pad 1.88: 3 -1.27,0; 4 1.27,0
SC70-6 = smd 0.3 x 0.66: 1 -0.65,-0.92; 2 0,-0.92; 3 0.65,-0.92; 4 0.65,0.92; 5 0,0.92; 6 -0.65,0.92
0402-TIGHT_NO_CREAM = smd 0.6 x 0.6: 1 -0.5,0; 2 0.5,0
TACTILE_SWITCH_SMD_RIGHT_ANGLE = smd 1.1 x 2: 1 -1.95,0; 2 1.95,0 | hole 0.7: 0,0.9; 0,-0.9
PAD.03X.05 = smd 1.27 x 1.27: 1 0,0
ESP-WROOM-32D-NARROW = smd 0.9 x 1.5: 1 6.43,8.238; 2 5.16,8.238; 3 3.89,8.238; 4 2.62,8.238; 5 1.35,8.238; 6 0.08,8.238; 7 -1.19,8.238; 8 -2.46,8.238; 9 -3.73,8.238; 10 -5,8.238; 11 -6.27,8.238; 12 -7.54,8.238; 13 -8.81,8.238; 14 -10.08,8.238; 25 -10.08,-8.238; 26 -8.81,-8.238; 27 -7.54,-8.238; 28 -6.27,-8.238; 29 -5,-8.238; 30 -3.73,-8.238; 31 -2.46,-8.238; 32 -1.19,-8.238; 33 0.08,-8.238; 34 1.35,-8.238; 35 2.62,-8.238; 36 3.89,-8.238; 37 5.16,-8.238; 38 6.43,-8.238 | smd 1.5 x 0.9: 15 -11.57,5.715; 16 -11.57,4.445; 17 -11.57,3.175; 18 -11.57,1.905; 19 -11.57,0.635; 20 -11.57,-0.635; 21 -11.57,-1.905; 22 -11.57,-3.175; 23 -11.57,-4.445; 24 -11.57,-5.715 | smd 1.33 x 1.33: GND1 -0.912,1.531; GNDT1 -2.751,3.346; GNDT2 -2.761,1.516; GNDT3 -2.751,-0.314; GNDT4 -0.891,-0.324; GNDT5 0.909,-0.314; GNDT6 0.909,1.516; GNDT7 0.909,3.346; GNDT8 -0.921,3.346
14-QFN = smd 0.25 x 0.6: 1 -0.25,1.35; 7 -0.25,-1.35; 8 0.25,-1.35; 14 0.25,1.35 | smd 0.6 x 0.25: 2 -1.1,1; 3 -1.1,0.5; 4 -1.1,0; 5 -1.1,-0.5; 6 -1.1,-1; 9 1.1,-1; 10 1.1,-0.5; 11 1.1,0; 12 1.1,0.5; 13 1.1,1 | smd 1 x 1.5: EPAD 0,0
SOT23-5 = smd 0.55 x 1.2: 1 -0.95,-1.3; 2 0,-1.3; 3 0.95,-1.3; 4 0.95,1.3; 5 -0.95,1.3
SO016 = smd 0.6 x 1.2: 1 -4.445,-2.8; 2 -3.175,-2.8; 3 -1.905,-2.8; 4 -0.635,-2.8; 5 0.635,-2.8; 6 1.905,-2.8; 7 3.175,-2.8; 8 4.445,-2.8; 9 4.445,2.8; 10 3.175,2.8; 11 1.905,2.8; 12 0.635,2.8; 13 -0.635,2.8; 14 -1.905,2.8; 15 -3.175,2.8; 16 -4.445,2.8
DFN-8 = smd 0.3 x 0.7: 1 -0.75,-0.99; 2 -0.25,-0.99; 3 0.25,-0.99; 4 0.75,-0.99; 5 0.75,0.99; 6 0.25,0.99; 7 -0.25,0.99; 8 -0.75,0.99 | smd 1.38 x 0.8: 9 0,0

### Placement (x,y rotation side)
C1  39.37,17.78 90 top
C2  38.1,17.78 90 top
C3  16.26,13.97 270 top
C4  17.27,13.97 270 top
C5  10.67,33.4 180 top
C6  12.83,35.43 90 top
C7  13.84,35.43 90 top
C8  36.83,17.78 90 top
C9  10.79,24.77 90 top
C10  12.7,19.18 0 top
C11  18.29,13.97 270 top
C12  19.3,13.97 270 top
C13  12.06,24.77 90 top
C14  13.34,24.77 90 top
C15  6.12,19.68 180 top
C16  8.89,19.05 180 top
C17  41.91,17.78 90 top
C18  40.64,17.78 90 top
C19  6.12,20.7 180 top
C20  8.89,20.07 180 top
C21  44.45,21.59 90 top
C22  45.47,21.59 90 top
C23  3.05,15.88 90 top
C24  46.48,21.59 90 top
C25  39.37,4.45 180 top
C26  38.1,21.59 90 top
C27  37.08,21.59 90 top
CHG  10.79,1.91 90 bottom
D1  6.86,22.35 0 top
D2  4.57,26.67 180 top
D3  4.57,24.13 180 top
D4  18.29,10.67 90 top
D5  10.79,1.91 270 top
D6  39.85,1.02 270 top
D7  12.7,1.91 270 top
FD1  49.78,3.3 0 top
FD2  49.78,3.3 0 bottom
FD3  2.54,35.56 0 bottom
FD4  2.54,35.56 0 top
FRAME1  88.9,-5.08 0 top  (outside the outline)
H1  12.7,8.89 0 top
H2  12.7,29.21 0 top
H3  38.1,8.89 0 top
H4  38.1,29.21 0 top
I2C  36.83,13.97 270 bottom
J1  24.45,4.11 0 bottom
J2  1.27,13.97 90 top
J3  45.72,5.08 0 top
J4  25.4,6.73 0 top
J5  1.27,29.21 90 top
J6  47.62,11.43 90 top
J7  49.53,16.51 90 top
J8  49.53,6.35 90 top
J9  5.08,6.99 180 top
LOGO1  25.4,31.75 0 bottom
LOGO2  44.45,30.48 0 top
LOGO3  62.23,54.61 0 top  (outside the outline)
LOGO4  45.21,6.86 0 top
MEAS  7.62,27.94 270 bottom
Q1  43.18,35.56 90 top
R1  13.34,33.4 0 top
R2  34.29,10.29 0 top
R3  34.29,11.3 0 top
R4  34.29,15.37 0 top
R5  34.29,13.84 0 top
R6  34.29,12.83 0 top
R7  15.24,13.97 270 top
R8  31.75,6.35 90 top
R9  19.05,6.35 90 top
R10  9.65,35.43 270 top
R11  40.64,35.56 180 top
R12  45.72,35.56 0 top
R13  16.38,6.35 90 top
R14  5.08,18.67 0 top
R15  36.96,13.97 180 top
R16  14.99,32.89 270 top
R17  10.67,32.38 180 top
R18  36.96,15.24 0 top
R19  17.65,6.35 90 top
RGB  39.37,1.91 90 bottom
S1  16.51,1.78 0 top
S2  34.29,1.78 0 top
SHLD  34.16,5.84 90 bottom
STAT  12.83,1.91 270 bottom
TP1  36.83,2.54 180 bottom
TP2  8.89,22.86 0 bottom
TP3  7.62,5.08 0 bottom
TP4  12.7,15.24 0 bottom
U1  25.4,27.94 90 top
U2  12.7,15.24 270 top
U3  12.7,21.59 270 top
U4  25.4,11.43 0 top
U5  8,15.88 0 top
U6  40.64,13.97 0 top
U7  4.95,15.88 0 top
U8  41.27,21.59 90 top
U$1  [DATALOGGER_IOT5]  25.4,22.61 0 bottom
U$2  [RESET0]  16.51,4.06 0 top
U$3  [STAT0]  12.7,5.33 90 top
U$4  [CHG0]  10.79,4.83 90 top
U$5  [#STAT_#0]  16.1,1.78 0 bottom
U$6  [#RGB#0]  39.29,3.71 0 bottom
U$7  [0_#_BOOT0]  34.29,4.06 0 top
U$8  [#_CHG#0]  10.79,4.83 90 bottom
U$9  [#MEAS#0]  7.62,30.99 0 top
U$10  [#MEAS#0]  9.14,27.94 90 bottom
U$11  [RGB0]  39.88,2.54 0 top
U$12  [#5#0]  48.77,26.67 0 bottom
U$13  [SFE_LOGO_FLAME_STOP_.1]  1.78,5.33 0 bottom
U$14  [DATALOGGER_IOT2]  42.16,25.65 0 top
U$16  [##RESET##0]  48.77,36.83 0 bottom
U$17  [#0_#_#BOOT##0]  48.77,34.29 0 bottom
U$18  [#36_#_A0#0]  48.77,31.75 0 bottom
U$19  [#39_#_A3#0]  48.77,29.21 0 bottom
U$21  [#17_#_TXD#0]  48.77,24.13 0 bottom
U$22  [#16_#_RXD#0]  48.77,21.59 0 bottom
U$23  [#25#0]  48.77,19.05 0 bottom
U$24  [#26#0]  48.77,16.51 0 bottom
U$25  [#SCL#0]  48.77,13.97 0 bottom
U$26  [#SDA#0]  48.77,11.43 0 bottom
U$27  [#3V3_SW#0]  48.77,8.89 0 bottom
U$28  [#GND#0]  48.77,6.35 0 bottom
U$29  [#GND#1]  2.03,16.51 0 bottom
U$30  [#GND#1]  2.03,21.59 0 bottom
U$31  [#GND#1]  2.03,26.67 0 bottom
U$32  [#BATT#0]  2.03,13.97 0 bottom
U$33  [#5V#0]  2.03,19.05 0 bottom
U$34  [#3V3#0]  2.03,24.13 0 bottom
U$35  [#33#0]  2.03,29.21 0 bottom
U$36  [#POCI_#_19#0]  2.03,31.75 0 bottom
U$37  [#PICO_#_23#0]  2.03,34.29 0 bottom
U$38  [#SCK_#_18#0]  2.03,36.83 0 bottom
U$45  [#SHLD#0]  34.8,5.84 0 bottom
U$46  [#I�C#0]  36.83,11.49 0 bottom
U$47  [STAT_LED0]  43.18,18.41 0 bottom
U$48  [RGB_LED0]  43.18,17.14 0 bottom

### Tracks (layer width: path | path; a pad name or v marks a point on that pad's centre or on a via)
3.3V  (via drill 0.3)
  Top 0.152: U6.14 40.89,15.57 41.06,15.75 v41.4,15.75 | U4.4 24.77,9.75 23.09,11.43 21.59,11.43 20.95,12.06 U4.16
  Top 0.254: U2.14 14.61,14.99 14.73,15.11 15.99,15.11 16.26,14.85 C3.1 C4.1 | v17.4,15.24 17.27,15.11 C4.1 | C4.1 C11.1 | U4.16 20.31,14.23 20.07,14.47 C12.1 C11.1 | v18.16,15.24 18.29,15.11 C11.1
  Top 0.406: v13.97,21.59 14,21.62 U3.5 14,23.34 v13.97,23.37 13.97,23.63 C14.1 C13.1 | v42.04,16.51 v42.04,16.52 41.91,16.64 C17.1 C18.1 v40.64,16.51 | v20.7,23.62 v20.7,21.72 | v29.08,24.89 v29.08,23.37
  Top 0.508: U1.2 15.91,33.1 15.61,33.4 14.99,33.4 R16.1 R1.2 C7.1 C6.1 11.18,34.93 | 11.18,34.93 R10.2 | v11.18,36.58 v11.18,35.81 11.18,34.93
  Bottom 0.152: I2C.2 v35.69,13.97
  pour Route15 (isolate 0.203, rank 2): 3.81,0 3.81,2.54 0,2.54 0,38.1 16.26,38.1 16.26,35.81 34.54,35.81 34.54,38.1 50.8,38.1 50.8,0
  pour Top: 11.18,35.56 10.67,35.05 11.68,35.05
3.3V_SW  (via drill 0.3)
  Top 0.406: C8.1 v36.83,16.51 | v38.1,16.51 C2.1 | C1.1 v39.37,16.51 | 34.79,14.6 v34.8,14.61 | 34.79,12.07 v34.8,12.06 | v44.2,9.91 v44.2,10.79 44.35,10.95 46.83,10.95 J6.2 | 45.22,3.18 45.21,3.17
  Top 0.508: 34.79,14.6 R5.2 R6.2 34.79,12.07 R3.2 R2.2 | R4.2 v34.8,14.61 | J8.2 48.01,7.37 48.01,3.81 47.37,3.17 45.21,3.17 40.28,3.17 | C26.1 C27.1 v37.08,20.32 | v38.1,20.32 C26.1 | U8.5 39.18,20.64 38.73,21.09 C26.1 | J3.2 45.22,3.18 | C25.1 40.28,4.03 40.28,3.17 | D6.2 40.28,1.36 40.28,3.17
  Route15 0.508: 37.47,16.51 v36.83,16.51 35.56,16.51 34.8,15.75 v34.8,14.61 v34.8,12.06 34.42,11.68 31.75,11.68 31.24,12.19 27.05,12.19 v26.29,12.95 v25.53,12.95 | 37.47,16.51 v38.1,16.51 v39.37,16.51 40.13,15.75 40.13,14.86 v44.2,10.79 | J8.2 47.62,10.79 v44.2,10.79 | v37.08,20.32 37.47,20.32 | 37.47,20.32 37.47,16.51 | v38.1,20.32 37.47,20.32 | v44.2,9.91 v44.2,10.79
  Bottom 0.406: J1.4 25.5,12.98 v25.53,12.95 v26.29,12.95
  pour Route15: 36.83,16.51 36.83,16.76 37.34,17.27 37.59,17.27 38.1,16.76 38.1,16.51
  pour Route15: 37.08,20.32 37.08,20.07 37.34,19.81 37.59,19.81 37.85,20.07 38.1,20.32
5V
  Top 0.508: J2.3 1.52,19.05 3.42,20.95 D3.A
!RESET!  (via drill 0.3)
  Top 0.152: U2.12 v13.2,13.34 v13.21,13.34 13.21,12.45 15.88,9.78 15.88,8.26 16.23,7.9 17.75,7.9 18.39,7.27 18.39,1.85 S1.2 | v37.85,33.02 38.48,33.66 38.48,35.94 39.37,36.83 44.07,36.83 | 44.07,36.83 J7.9 | Q1.3 44.07,36.24 44.07,36.83 | U1.3 16.21,31.83 v15.88,31.5 15.88,28.84 15.21,28.18 15.21,20.33 15.52,20.02 15.52,16.03 v15.24,15.75 | C5.1 v11.94,33.4 R1.1
  Bottom 0.152: v37.85,33.02 35.74,33.02 33.46,30.73 28.19,30.73 27.18,31.75 16.64,31.75 16.38,31.5 v15.88,31.5 15.23,31.5 13.32,33.4 v11.94,33.4 | v13.21,13.34 12.18,13.34 11.74,12.9 11.74,12.5 12.02,12.22 14.76,12.22 15.24,12.7 v15.24,15.75
CH340-DTR  (via drill 0.3)
  Top 0.152: R11.2 v39.37,35.56 v39.37,33.02 | Q1.1 43.58,34.91 43.18,35.31 v43.18,35.56 | U4.13 24.77,12.09 25.27,11.58 30.23,11.58 31.85,13.21 31.85,23.51 29.49,25.87 v29.49,29.72
  Bottom 0.152: v39.37,35.56 v43.18,35.56 | v29.49,29.72 29.55,29.77 33.29,29.77 35.77,32.26 38.61,32.26 v39.37,33.02
CH340-RTS  (via drill 0.3)
  Top 0.152: R12.2 v46.99,35.56 | Q1.4 41.62,36.21 41.48,36.35 v41.4,36.35 39.41,36.35 38.83,35.77 38.83,33.27 v38.58,33.02 | v29.97,30.25 29.97,25.91 32.13,23.75 32.13,13.08 30.35,11.3 25.15,11.3 23.5,12.95 U4.14
  Bottom 0.152: v46.99,35.56 46.2,36.35 v41.4,36.35 | v38.58,33.02 38.1,32.54 35.66,32.54 33.37,30.25 v29.97,30.25
CH340-RX  (via drill 0.3)
  Top 0.152: U1.35 33.56,30.48 32.26,30.48 31.75,29.97 31.75,26.75 v31.85,26.65 | v22.86,10.58 23.5,9.94 U4.3 | v23.41,23.62 23.29,23.5 v23.29,18.16
  Bottom 0.152: v31.85,26.65 24.11,26.65 23.37,25.91 23.37,23.67 v23.41,23.62 | v23.29,18.16 21,18.16 20.45,17.61 20.45,14.13 22.48,12.1 22.48,10.96 v22.86,10.58
CH340-TX  (via drill 0.3)
  Top 0.152: U1.34 32.59,29.29 32.23,28.93 v32.23,27.3 | v22.05,10.58 22.05,9.69 22.23,9.52 U4.2 | v22.73,23.62 v22.73,18.67
  Bottom 0.152: v32.23,27.3 24.37,27.3 22.71,25.64 22.71,23.65 v22.73,23.62 | v22.05,10.58 22.05,12.1 20.17,13.98 20.17,17.77 21.07,18.67 v22.73,18.67
D+
  Top 0.305: U4.5 26.04,8.26 25.15,7.37 J4.A6 25.15,5.08 25.4,4.83 26.04,4.83 26.29,5.08 26.29,5.62 26.15,5.76 J4.B6
D-  (via drill 0.3)
  Top 0.305: U4.6 27.3,8.26 26.67,7.62 26.14,7.62 25.65,7.13 J4.A7 25.65,5.4 v25.71,5.4 | J4.B7 24.65,5.5 24.59,5.45 v24.59,5.4
  Bottom 0.305: v25.71,5.4 v24.59,5.4
ESP0/!BOOT!  (via drill 0.3)
  Top 0.152: J7.8 42.29,34.29 | Q1.6 42.26,34.32 42.29,34.29 | v40.13,33.02 40.13,33.78 40.64,34.29 42.29,34.29 | U1.25 v35.01,17.86 35.31,18.16 35.31,30.89 v36.2,31.78 | S2.2 36.24,4.3 v35.46,5.08
  Bottom 0.152: v40.13,33.02 39.09,31.98 36.4,31.98 v36.2,31.78 | v35.46,5.08 35.66,5.28 35.66,6.6 34.75,7.52 34.75,10.26 35.43,10.95 35.43,12.19 35.18,12.45 35.18,14.22 35.43,14.48 35.43,14.73 35.01,15.16 v35.01,17.86
ESP2/DAT0  (via drill 0.3)
  Top 0.152: U2.1 14.47,15.49 14.61,15.62 v14.61,17.25 | U1.24 31.11,17.4 28.07,20.45 v26.42,20.45
  Bottom 0.152: v26.42,20.45 26.29,20.57 20.18,20.57 16.44,16.84 15.02,16.84 v14.61,17.25
ESP4/DAT1  (via drill 0.3)
  Top 0.152: U1.26 32.59,19.13 32.41,18.95 32.41,15.98 v33.02,15.37 R4.1
  Bottom 0.152: J1.8 29.9,15.93 30.48,16.51 31.88,16.51 v33.02,15.37
ESP5  (via drill 0.3)
  Top 0.152: v34.8,25.65 34.8,23.11 34.62,22.94 U1.29
  Bottom 0.152: J7.5 48.26,26.67 47.52,25.93 35.08,25.93 v34.8,25.65
ESP12/DAT2  (via drill 0.3)
  Top 0.152: U2.4 v12.7,18.29 | v16,18.03 16.18,17.86 U1.14
  Bottom 0.152: v16,18.03 15.75,18.29 v12.7,18.29
ESP13/DAT3  (via drill 0.3)
  Top 0.152: U1.16 21.18,16.6 v21.18,17.65 | R2.1 30.36,10.29 v30.1,10.54
  Bottom 0.152: J1.2 23.3,12.14 | v21.18,17.65 21.18,13.87 22.92,12.14 23.3,12.14 | v30.1,10.54 30.05,10.6 24.84,10.6 23.3,12.14
ESP14/CLK  (via drill 0.3)
  Top 0.152: U1.13 19.22,19.13 v19.32,19.04
  Bottom 0.152: v19.32,19.04 19.32,19.32 20.3,20.3 25.43,20.3 26.6,19.12 J1.5
ESP15/CMD  (via drill 0.3)
  Top 0.152: U2.8 10.8,14.99 10.67,14.86 v10.67,13.59 | v24.13,19.18 28.07,19.18 29.84,17.4 U1.23
  Bottom 0.152: v10.67,13.59 10.7,13.56 10.7,12.76 11.79,11.66 14.99,11.66 15.9,12.57 15.9,14.49 20.59,19.18 v24.13,19.18
ESP16/RXD  (via drill 0.3)
  Top 0.152: U1.27 34.75,20.4 v34.83,20.32
  Bottom 0.152: v34.83,20.32 35.31,20.8 35.31,23.35 36.95,24.99 46.13,24.99 J7.3
ESP17/TXD  (via drill 0.3)
  Top 0.152: U1.28 34.75,21.67 v34.83,21.59
  Bottom 0.152: v34.83,21.59 34.83,23.52 36.83,25.53 46.35,25.53 47.75,24.13 J7.4
ESP18/SCK  (via drill 0.3)
  Top 0.152: U1.30 32.81,24.21 30.99,26.04 30.99,31.88 v31.75,32.64
  Bottom 0.152: v31.75,32.64 15.37,32.64 13.31,34.7 5.31,34.7 3.17,36.83 J5.4
ESP19/POCI  (via drill 0.3)
  Top 0.152: U1.31 32.18,25.48 31.37,26.29 31.37,30.89 v31.98,31.5 | J5.2 5.33,35.81 5.45,35.93 R10.1
  Bottom 0.152: J5.2 3.4,33.88 13.23,33.88 15.09,32.03 27.29,32.03 27.83,31.5 v31.98,31.5
ESP21/SDA  (via drill 0.3)
  Top 0.152: U1.33 34.62,28.02 34.92,28.32 34.92,31.31 35.87,32.26 39.12,32.26 40.89,30.48 v40.89,23.24 | U6.4 38.78,13.97 v38.73,13.92 37.5,13.92 R15.1 | v4.04,17.78 4.2,17.61 U7.8
  Bottom 0.152: v40.89,23.24 42.9,21.24 42.9,16.36 41.66,15.11 38.56,15.11 38.26,14.8 38.26,14.4 v38.73,13.92 38.73,13.9 38.08,13.24 38.08,12.19 35.31,9.42 35.31,7.75 36.32,6.73 36.32,4.83 35.31,3.81 34.54,3.81 33.53,2.79 20.41,2.79 16.85,6.35 15.24,6.35 12.7,3.81 5.08,3.81 4.32,4.57 4.32,17.5 v4.04,17.78 | v40.89,23.24
ESP22/SCL  (via drill 0.3)
  Top 0.152: U1.36 35.05,31.83 35.75,32.54 39.23,32.54 41.25,30.52 41.25,23.57 v41.58,23.24 | U6.11 v43.02,13.97 43.02,14.32 43.18,14.48 43.18,15.62 42.8,16 41.83,16 41.6,16.23 41.12,16.23 40.77,15.88 38.73,15.88 38.1,15.24 | 38.1,15.24 R18.2 | 38.1,15.24 38.1,15.28 v38.42,15.59 | v4.72,17.78 4.7,17.77 U7.7
  Bottom 0.152: v41.58,23.24 43.18,21.64 43.18,14.13 v43.02,13.97 | v38.42,15.59 37.8,14.97 37.8,12.31 35.03,9.54 35.03,7.63 35.94,6.72 35.94,4.85 35.18,4.09 34.43,4.09 33.41,3.07 20.56,3.07 17.01,6.63 15.12,6.63 12.58,4.09 5.2,4.09 4.6,4.69 4.6,17.66 v4.72,17.78
ESP23/PICO  (via drill 0.3)
  Top 0.152: v32.26,32.13 32.26,32.74 32.62,33.1 U1.37
  Bottom 0.152: v32.26,32.13 27.69,32.13 27.46,32.36 15.25,32.36 13.32,34.29 J5.3
ESP25/LED  (via drill 0.3)
  Top 0.152: v15.97,23.21 16.89,23.21 U1.10 | R19.2 17.65,7.37 17.4,7.62 16,7.62 14.25,5.87 v11.79,5.87 v11.78,5.87
  Bottom 0.152: v11.78,5.87 11.29,5.87 10.61,6.55 9.48,6.55 8.18,7.85 8.18,11.59 9.53,12.94 9.53,21.97 11.68,24.13 15.06,24.13 v15.97,23.21 16.89,24.13 20.95,24.13 22.23,22.86 33.02,22.86 34.09,21.79 34.09,20.12 34.63,19.59 35.02,19.59 35.84,20.4 35.84,23.14 37.16,24.46 46.01,24.46 48.26,22.21 48.26,20.32 J7.2
ESP26/RGBLED  (via drill 0.3)
  Top 0.152: v18.41,21.72 18.37,21.67 U1.11
  Bottom 0.152: v18.41,21.72 19.59,22.89 21.29,22.89 21.86,22.33 32.9,22.33 33.56,21.67 33.56,20 34.51,19.05 35.14,19.05 36.37,20.29 36.37,23.02 37.28,23.93 46.15,23.93 47.73,22.35 47.73,18.31 J7.1 47.32,14.3 47.32,8.26 46.85,7.78 44.74,7.78 41.53,4.57 41.53,2.79 41.16,2.43 RGB.2
ESP32/PWREN  (via drill 0.3)
  Top 0.152: U1.8 18.46,25.48 19.05,24.89 v19.05,23.62 | U2.11 12.7,12.23 12.19,11.73 11.01,11.73 v10.67,12.06
  Bottom 0.152: v19.05,23.62 17.27,23.62 16.38,22.73 15.78,22.73 14.66,23.85 11.8,23.85 9.8,21.86 9.8,12.93 v10.67,12.06
ESP33  (via drill 0.3)
  Top 0.152: U1.9 16.05,24.21 v15.97,24.13
  Bottom 0.152: v15.97,24.13 15.14,24.97 7.25,24.97 3.01,29.21 J5.1
ESP35/A7  (via drill 0.3)
  Top 0.152: R16.2 v11.94,32.39 11.18,32.39 R17.1 | U1.7 v15.88,26.75
  Bottom 0.152: v15.88,26.75 15.88,30.1 13.58,32.39 v11.94,32.39
ESP36/A0  (via drill 0.3)
  Top 0.152: v18.54,30.48 18.46,30.56 U1.4
  Bottom 0.152: J7.7 47.24,29.46 47.24,28.07 46.23,27.05 36.32,27.05 34.16,29.21 28.45,29.21 26.57,31.09 19.15,31.09 v18.54,30.48
ESP39/A3  (via drill 0.3)
  Top 0.152: U1.5 18.11,29.29 v18.54,29.72
  Bottom 0.152: v18.54,29.72 19.38,30.56 26.33,30.56 28.2,28.68 34.05,28.68 36.21,26.52 46.84,26.52 J7.6
GND  (via drill 0.3)
  Top 0.152: U7.6 5.2,16.12 U7.9 | U7.1 4.2,15.38 4.7,15.88 U7.9 | U7.4 5.7,15.38 5.21,15.88 U7.9 | U2.EPAD 12.45,15.49 U2.7 10.93,15.49 10.67,15.75 v10.67,15.88 | U6.6 39.89,12.97 40.64,13.72 U6.EPAD 40.64,14.22 41.39,14.97 U6.13
  Top 0.254: J4.GND2 28.62,5.84 28.92,5.55 28.92,4.79 v27.94,3.81 | J4.GND 22.18,5.84 21.88,5.55 21.88,4.79 v22.86,3.81 | C3.2 16.26,12.95 v16.51,12.7 | U6.7 v40.39,11.43 | U6.13 42.14,15.37 v42.67,15.37
  Top 0.406: v8,15.88 U5.2
  Bottom 0.305: SHLD.1 v34.16,4.57
  other vias: 31.11,1.91 31.11,4.45 37.47,1.4 7.11,12.7 7.11,8.89 7.11,10.79 15.75,2.16 18.54,34.29 12.83,36.83 13.84,36.83 19.3,5.08 19.3,12.7 20.95,9.91 12.7,21.59 13.97,19.18 12.06,26.16 13.34,26.16 10.79,26.16 41.94,33.02 46.99,33.02 31.75,34.29 22.1,29.97 25.78,29.97 25.78,24 22.1,24 23.88,29.97 24.13,24 45.49,22.86 44.48,22.86 46.51,22.86 41.05,21.59 39.37,19.05 40.64,19.05 41.91,19.05 36.7,19.05 38.23,19.05 2.54,30.48 17.78,12.7 10.35,21.59 42.86,4.83 44.2,3.94 45.59,9.91 37.11,22.86 38.1,22.86 38.1,4.45 28.45,29.97 19.68,17.53 35.84,25.4 48.29,25.4 27.69,13.21 32.77,12.45 30.48,20.32 48.29,35.56 3.56,35.56 25.4,17.78 19.68,1.91 18.29,8.64 4.57,22.99 14.48,14.35 5.65,35.37 35.56,36.96 8.51,18.29 22.86,34.29 26.67,34.29 1.27,12.45 0.76,3.05 8.64,1.78 5.33,4.83 33.53,7.62 47.5,15.49 46.23,27.94 41.91,27.69 40.13,27.69 48.26,37.47 36.83,33.66 27.3,28.19 27.3,25.91 20.35,25.15 10.41,19.81 18.54,16 16.26,16.26 9.14,33.27 10.16,31.5 4.57,36.83 15.75,34.29 35.05,34.54 32.38,26.16 5.59,17.78 42.42,23.37 40.13,23.37 45.09,11.68 4.7,20.32 7.49,20.07 36.22,11.51 32.77,10.79 30.99,9.73
  pour Top (isolate 0.203, rank 2): 3.81,0 3.81,2.54 0,2.54 0,38.1 16.26,38.1 16.26,35.81 34.54,35.81 34.54,38.1 50.8,38.1 50.8,0
  pour Bottom (isolate 0.203): 3.81,0 3.81,2.54 0,2.54 0,38.1 16.26,38.1 16.26,35.81 34.54,35.81 34.54,38.1 50.8,38.1 50.8,0
  pour Route2 (isolate 0.203): 3.81,0 3.81,2.54 0,2.54 0,38.1 16.26,38.1 16.26,35.81 34.54,35.81 34.54,38.1 50.8,38.1 50.8,0
N$1
  Top 0.152: J4.B5 27.15,7.08 27.3,7.24 31.36,7.24 R8.2
N$2
  Top 0.152: J4.A5 24.15,7.09 24,7.24 19.44,7.24 R9.2
N$3
  Top 0.508: D1.C 5.72,22.37 D3.C D2.C 5.72,28.58 6.35,29.21 MEAS.3
  Bottom 0.508: MEAS.3 MEAS.1
N$4
  Top 0.152: Q1.2 R12.1
N$5
  Top 0.152: Q1.5 R11.1
N$6  (via drill 0.3)
  Top 0.152: R19.1 17.78,5.72 v17.78,4.7
  Bottom 0.152: STAT.2 15.73,1.38 16.13,1.78 17.02,1.78 17.78,2.54 v17.78,4.7
N$7  (via drill 0.3)
  Top 0.152: D6.4 38.45,2.44 v37.72,3.17
  Bottom 0.152: TP1.1 37.08,2.54 v37.72,3.17
N$8  (via drill 0.3)
  Top 0.152: v9.4,1.14 9.4,1.39 D5.A
  Bottom 0.152: CHG.1 9.64,1.38 v9.4,1.14
N$9
  Top 0.152: R13.1 15.37,5.85 14.22,4.7 12.19,4.7 11.81,4.32 11.81,2.04 D5.C
N$10  (via drill 0.3)
  Top 0.152: v7.11,15.88 7.05,15.81 U5.1 | v11.81,5.08 14.11,5.08 15.88,6.85 R13.2
  Bottom 0.152: v7.11,15.88 7.11,15.24 7.62,14.73 7.62,7.62 8.89,6.35 | v11.81,5.08 10.16,5.08 8.89,6.35 | TP3.1 8.89,6.35
N$11
  Top 0.152: R14.2 5.96,18.29 6.73,18.29 7.05,17.97 U5.5
N$12  (via drill 0.3)
  Top 0.152: D6.3 41.25,1.63 v41.78,2.16
  Bottom 0.152: RGB.1 41.01,1.38 v41.78,2.16
N$13  (via drill 0.3)
  Top 0.152: D7.A 13.03,3.12 v13.78,3.12
  Bottom 0.152: v13.78,3.12 13.09,2.43 STAT.1
N$16  (via drill 0.3)
  Top 0.152: R18.1 v35.69,15.24
  Bottom 0.152: v35.69,15.24 35.92,15.01 I2C.1
N$17  (via drill 0.3)
  Top 0.152: R15.2 36.46,13.47 v35.69,12.7
  Bottom 0.152: v35.69,12.7 35.92,12.93 I2C.3
PWREN  (via drill 0.3)
  Top 0.152: U6.12 42.41,14.47 v42.55,14.61 | U2.13 13.7,13.46 | 13.7,13.46 13.7,12.71 v13.69,12.7 | R7.2 13.71,13.47 13.7,13.46 | v12.22,12.7 12.22,14.12 U2.10 | U2.5 12.2,16.88 v11.94,17.14 11.7,16.91 U2.6 | U8.3 43.37,22.54 v43.69,22.86 | v41.15,19.68 v43.66,19.68 | v38.86,12.7 38.86,13.34 39,13.47 U6.5
  Bottom 0.152: v42.55,14.61 42.04,14.1 | 42.04,14.1 40.64,12.7 v38.86,12.7 | v12.22,12.7 v13.69,12.7 13.69,15.39 13.27,15.81 | 13.27,15.81 v11.94,17.14 11.94,18.2 12.5,18.77 12.9,18.77 13.1,18.57 16.99,18.57 18.57,20.15 18.57,20.9 18.88,21.21 26.81,21.21 29.48,18.54 35.43,18.54 36.58,19.68 v41.15,19.68 | v43.69,22.86 43.5,22.67 43.5,19.68 | 43.5,19.68 43.5,13.77 43.22,13.49 42.64,13.49 42.04,14.1 | TP4.1 13.27,15.81 | v43.66,19.68 43.5,19.68
QWIIC_SCL  (via drill 0.3)
  Top 0.152: J8.4 48.51,12.95 46.87,12.95 J6.4 43.33,12.93 42.79,13.47 U6.10 | J3.4 47.22,6.12 47.12,6.22 v47.12,7.24
  Bottom 0.152: v47.12,7.24 47.6,7.72 47.6,12.04 J8.4
QWIIC_SDA  (via drill 0.3)
  Top 0.152: J8.3 48.26,11.43 47.74,11.95 46.87,11.95 J6.3 45.6,11.93 v45.09,12.45 | J3.3 46.22,6.04 46.04,6.22 v46.04,7.24 | U6.3 38.87,14.47 v38.73,14.61
  Bottom 0.152: v46.04,7.24 46.04,6.73 46.42,6.35 47.37,6.35 47.88,6.86 47.88,9.78 J8.3 | v38.73,14.61 39.24,14.1 39.24,13.46 39.1,13.32 38.67,13.32 38.35,13 38.35,12.53 38.82,12.06 44.7,12.06 v45.09,12.45
SD_CMD  (via drill 0.3)
  Top 0.152: U2.9 11.7,13.48 11.43,13.21 v11.3,13.21 | R6.1 33.66,12.95 32.52,12.95 31.11,11.55 v31.11,11.2
  Bottom 0.152: v11.3,13.21 11.3,12.54 11.9,11.94 14.88,11.94 15.62,12.69 15.62,14.61 20.67,19.66 24.41,19.66 24.65,19.42 24.65,14.87 J1.3 24.4,12.43 25.25,11.59 30.73,11.59 v31.11,11.2
SD_DAT0  (via drill 0.3)
  Top 0.152: U2.2 13.7,17.34 v13.74,17.38 | R5.1 33.79,14.6 v33.78,14.61
  Bottom 0.152: v13.74,17.38 14.09,17.73 15.23,17.73 15.72,17.24 16.45,17.24 20.14,20.93 26.7,20.93 28.8,18.83 28.8,16.76 | 28.8,16.76 J1.7 | v33.78,14.61 33.78,15.28 32.28,16.79 28.82,16.79 28.8,16.76
SD_DAT2  (via drill 0.3)
  Top 0.152: U2.3 v13.2,17.8 v13.21,17.81 | v19.05,20.7 v22.1,17.65 | R3.1 32,11.3 31.43,10.72 30.68,10.72 30.38,11.02 24.78,11.02 22.89,12.91 v22.82,12.91
  Bottom 0.152: v13.21,17.81 13.41,18.01 15.35,18.01 15.84,17.52 16.34,17.52 19.05,20.23 v19.05,20.7 | v22.1,17.65 22.2,17.55 J1.1 22.2,13.52 22.8,12.91 v22.82,12.91
SHIELD  (via drill 0.3)
  Route2 0.305: J4.SHLD1 21.08,5.18 20.57,4.66 20.57,3.21 21.08,2.7 J4.SHLD3 J4.SHLD4 29.72,2.7 30.23,3.21 30.23,4.66 29.72,5.17 J4.SHLD2 32.87,5.82 v34.16,7.11
  Bottom 0.305: v34.16,7.11 SHLD.2
V_BATT
  Top 0.305: U7.2 4.7,13.97 | U7.3 5.2,13.97
  Top 0.406: 4.2,13.97 4.19,13.97 4.08,13.86 | 4.7,13.97
  Top 0.508: 4.19,13.97 3.05,13.97 | 3.05,13.97 J2.1 | 4.2,13.97 4.7,13.97 5.2,13.97 | J9.2 4.08,13.86 | 4.7,13.97 5.34,13.97 5.85,13.46 8.38,13.46 8.95,14.03 U5.3 9.49,14.57 9.91,14.99 9.91,18.53 C16.1 C20.1 9.39,20.52 9.02,20.89 8.61,20.89 8.01,21.5 D1.A | C23.1 3.05,13.97
V_USB  (via drill 0.3)
  Top 0.406: v23.5,4.45 23.5,5.33 22.95,5.88 J4.VBUS1 | v27.3,4.45 27.3,5.33 27.85,5.88 J4.VBUS2
  Top 0.508: v19.56,11.18 19.22,11.52 D4.2 17.23,11.52 v16.89,11.18
  Top 0.635: v3.17,25.15 3.42,25.39 D2.A 3.42,27.69 v3.17,27.93 v3.17,27.94
  Route15 0.711: v27.3,4.45 v23.5,4.45 23.5,6.99 24.13,7.62 24.13,10.41 23.08,11.46 21.48,11.46 21.2,11.18 v19.56,11.18 v16.89,11.18 9.65,11.18 8.89,11.94 8.89,12.7 7.62,13.97 3.81,13.97 3.17,14.61 v3.17,25.15 v3.17,27.94
VIN  (via drill 0.3)
  Top 0.152: U5.4 8.95,15.94 v8.89,15.88 | v9.4,2.54 9.78,2.92 9.78,5.81 v10.03,6.07
  Top 0.508: C24.1 v46.48,20.32 45.47,20.32 | 45.47,20.32 v44.45,20.32 C21.1 43.95,21.09 43.5,20.64 U8.1 | C22.1 45.47,20.32 | v12.7,22.48 12.64,22.54 U3.1 | U3.3 12.64,20.64 v12.7,20.7 | C10.1 11.4,19.98 U3.3 | U5.4 8.35,17.18 7.87,17.65 7.87,17.91 6.62,19.16 C15.1 C19.1 6.62,23.27 v7.62,24.27 | U3.1 11.4,23.14 10.79,23.75 C9.1 v7.62,24.27 | U3.1 10.22,22.54 9.69,22.01 9.69,21.3 10.35,20.64 U3.3 | v7.62,24.27 MEAS.4
  Route15 0.508: v46.48,20.32 v44.45,20.32 44.07,20.32 43.69,20.7 40.77,20.7 39.5,21.97 36.45,21.97 34.29,24.13 27.43,24.13 26.92,23.62 26.92,22.23 26.54,21.84 21.72,21.84 21.08,22.48 v12.7,22.48 12.19,22.48 11.94,22.23 11.94,20.95 12.19,20.7 v12.7,20.7
  Bottom 0.152: v8.89,15.88 8.89,12.7 7.9,11.71 7.9,7.74 9.57,6.07 v10.03,6.07 | v9.4,2.54 10.68,2.54 CHG.2 | v7.62,24.27 7.62,24.13 TP2.1
  Bottom 0.508: MEAS.4 MEAS.2
  pour Top: 7.62,24.13 8.64,24.13 7.62,25.15

### Text on the board
Route2: 2
Route15: 3
Bottom: v11
Measures: Dimensions / In Inches
tDocu: 4-Layers / 1.6mm Thickness / 1oz Copper / Lead-Free HASL Finish / Red Solder Resist / White Silkscreen / Stackup: JLC7628 / Material: TG155 | Alex Brudner | Original design by: | Paul Clark